# Altium project SCH-90818_A.PrjPcb (part 1 of 3)
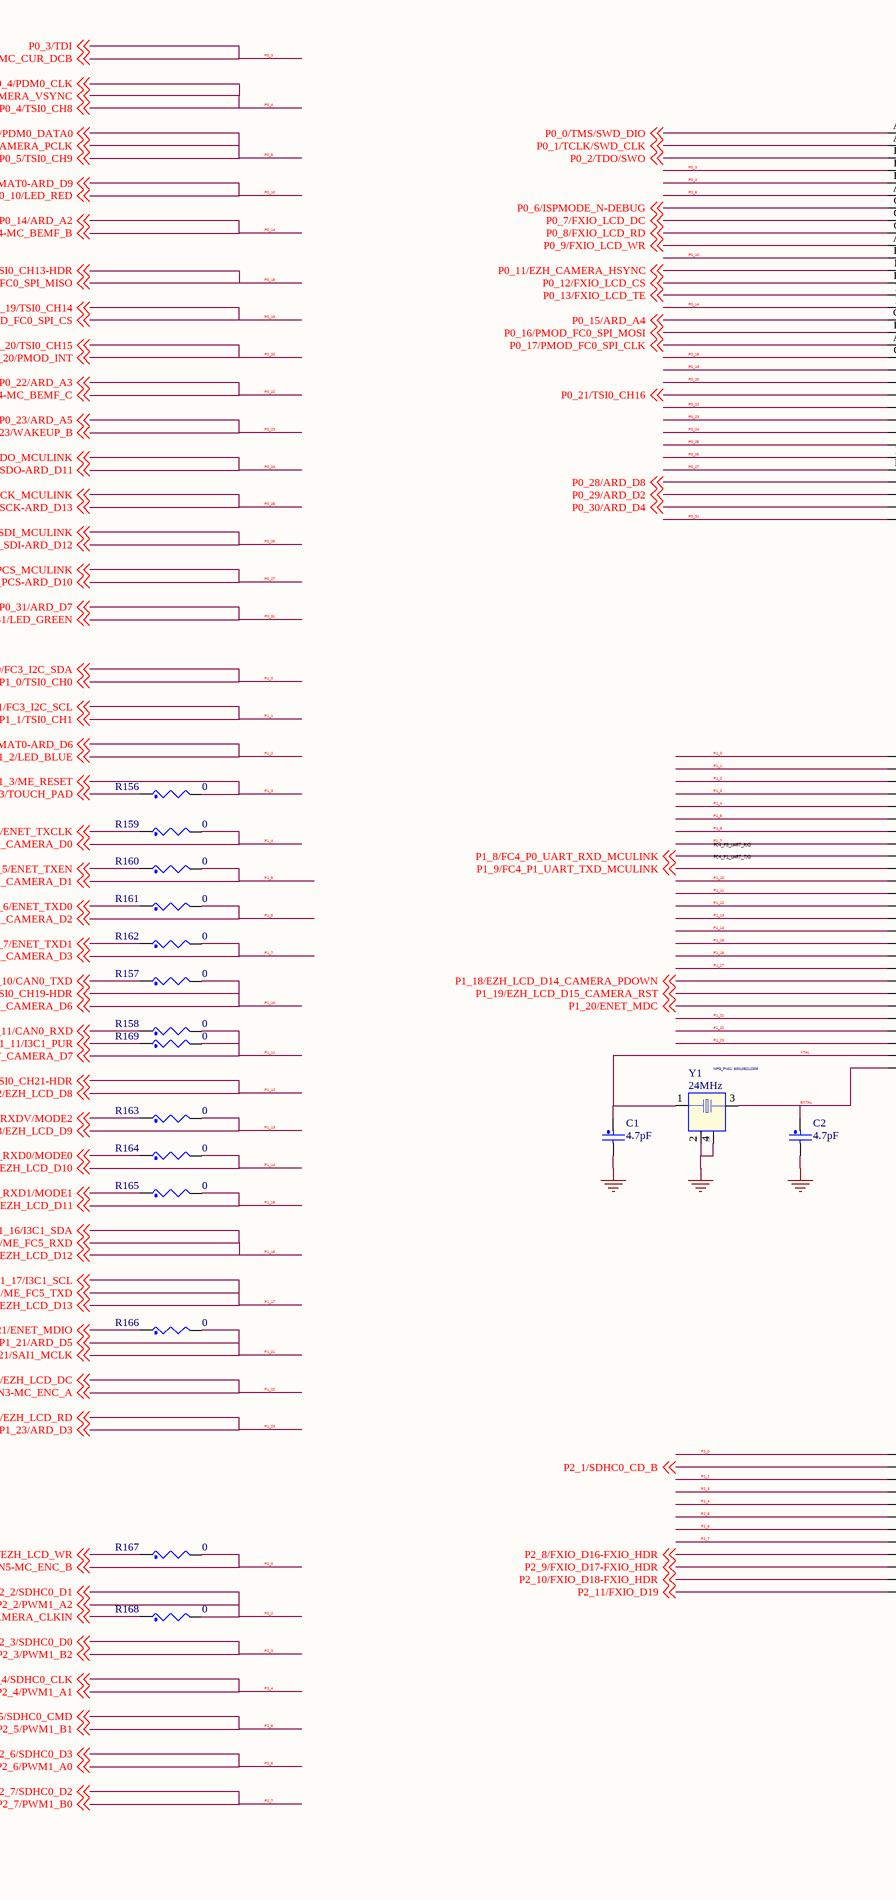
[diagram p0: 03 SOC_PORT0~2.SchDoc, left]
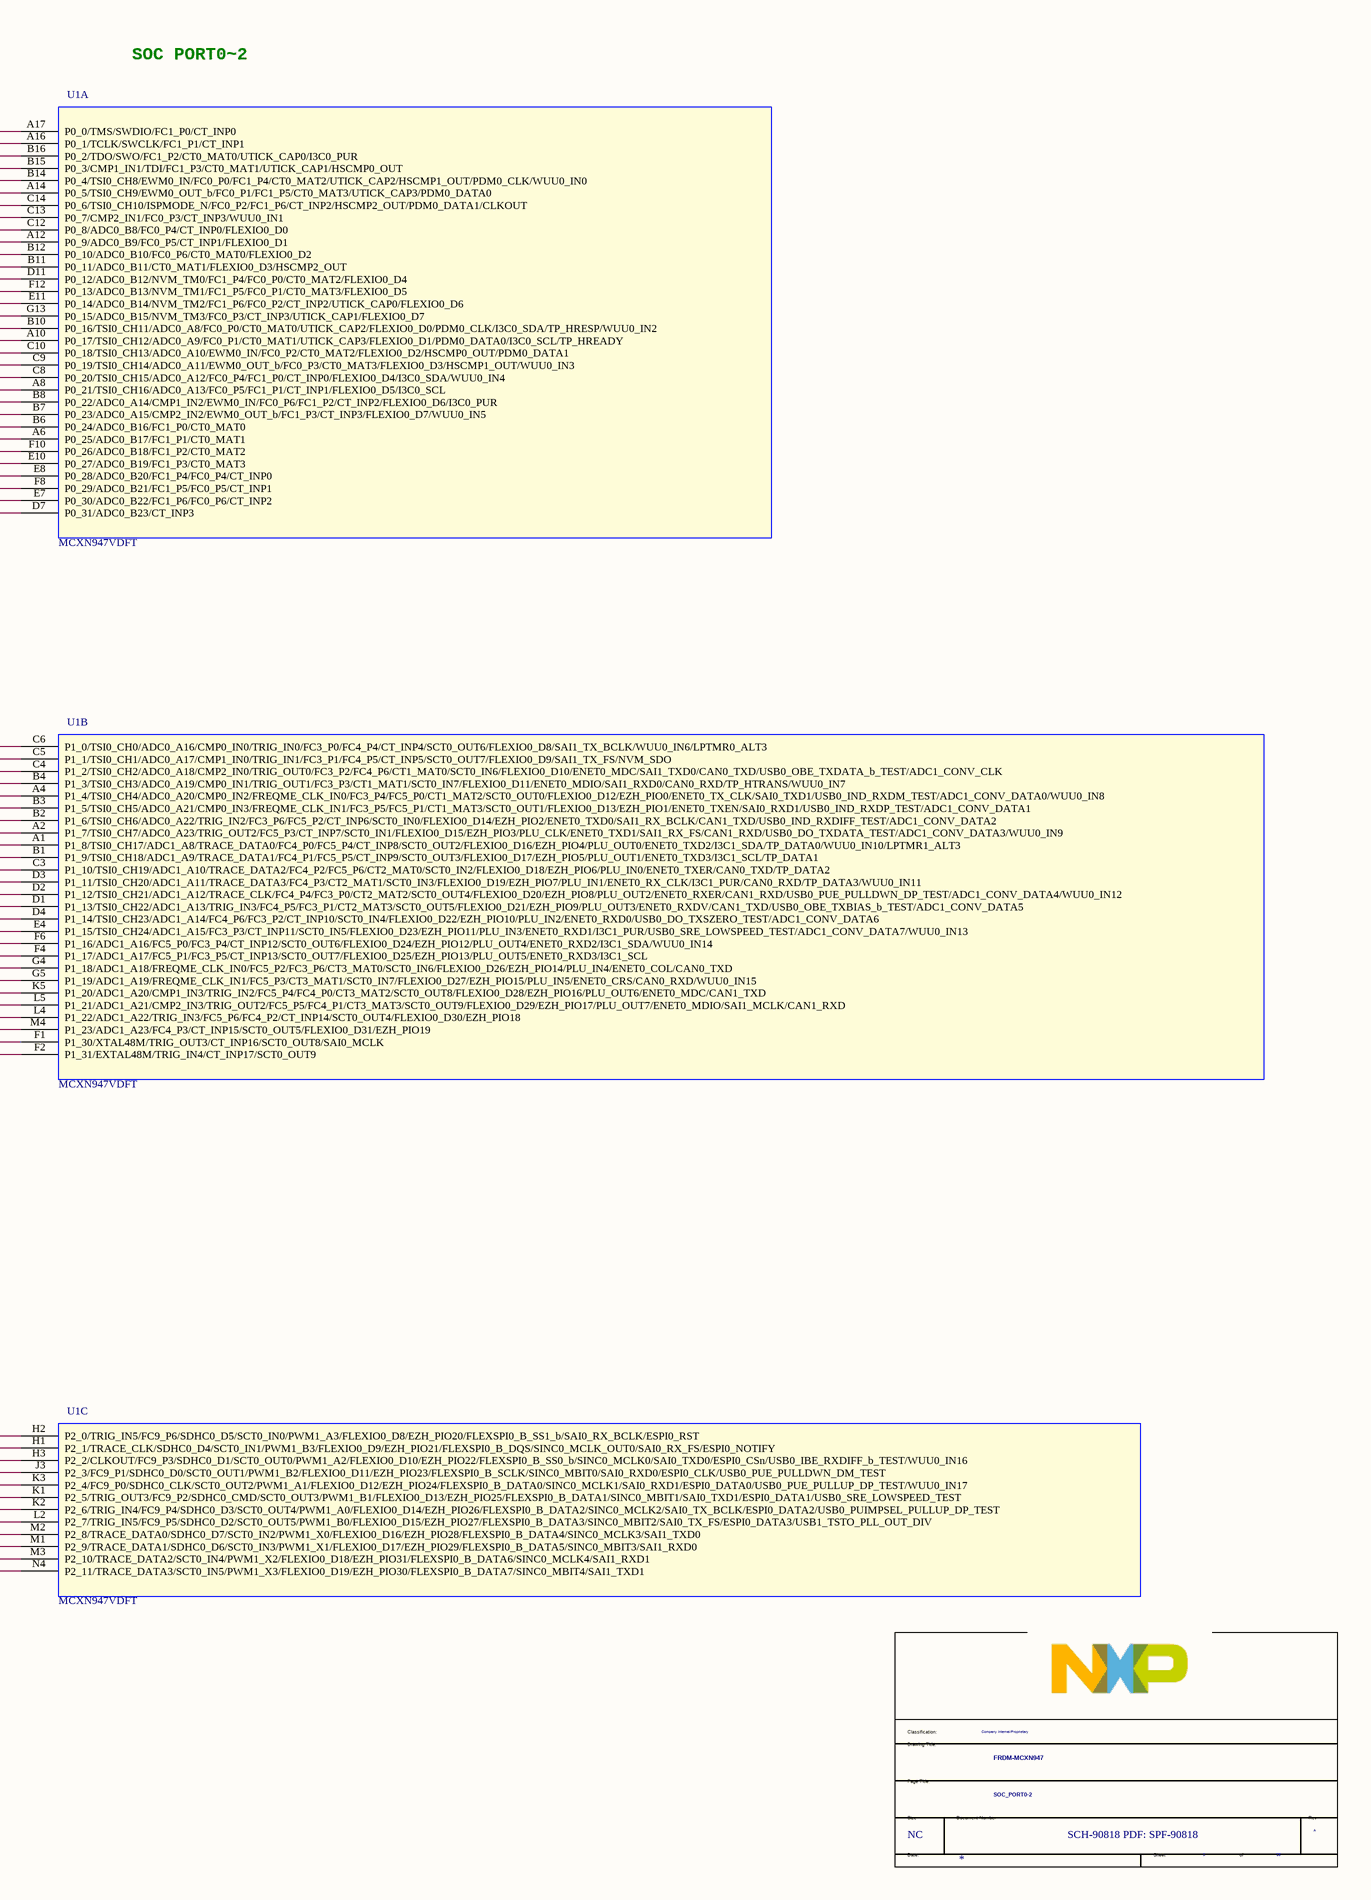
[diagram p1: 03 SOC_PORT0~2.SchDoc, right]
7 sheets, 307 parts. Net scope: global (net labels, ports and power ports of the same name join across sheets).
Sheets:
  03 SOC_PORT0~2.SchDoc
  04 SOC_PORT3~5.SchDoc
  06 USB & PWR.SchDoc
  07 SD & QSPI & SENSOR.SchDoc
  08 CAN PHY & ETHERNET P.SchDoc
  09 MCU_LINK_USB.SchDoc
  10 MCU_LINK_DEBUG.SchDoc

## Sheet 03 SOC_PORT0~2.SchDoc
size 513 x 386 mm

### Parts
(Parts that share a designator on the sheet are numbered #1, #2 ... from top to bottom, then left to right.)
*#1  Doc: SCH-90818 PDF: SPF-90818  RevCode: A  Title: FRDM-MCXN947  Page Size: NC  Page Number: 3  Page Count: 13  PageTitle: SOC_PORT0-2  Classification: Company Internal/Proprietary  (hidden comment: TitleBlock_FS)  (graphical)
C1  4.7pF  [CC0402_25]
C2  4.7pF  [CC0402_25]
R156  0  [RC0603_OV]
R157  0  [RC0603_OV]
R158  0  [RC0603_OV]
R159  0  [RC0603_OV]
R160  0  [RC0603_OV]
R161  0  [RC0603_OV]
R162  0  [RC0603_OV]
R163  0  [RC0603_OV]
R164  0  [RC0603_OV]
R165  0  [RC0603_OV]
R166  0  [RC0603_OV]
R167  0  [RC0402_25]
R168  0  [RC0603_OV]
R169  0  [RC0402_25]
U1  MCXN947VDFT  [bga184_0p5_9x9_sm]  (parts A,B,C of 8)
Y1  24MHz  MFG_PN01: 830108212309  [xtal4_2p1x1p7mm_sm]

### Nets
GND: C1.2 C2.2 Y1.2(GND1) Y1.4(GND2)
EXTAL: C2.1 U1.F2(P1_31/EXTAL48M/TRIG_IN4/CT_INP17/SCT0_OUT9) Y1.3
P0_0/TMS/SWD_DIO: U1.A17(P0_0/TMS/SWDIO/FC1_P0/CT_INP0) ; off-sheet P0_0/TMS/SWD_DIO
P0_1/TCLK/SWD_CLK: U1.A16(P0_1/TCLK/SWCLK/FC1_P1/CT_INP1) ; off-sheet P0_1/TCLK/SWD_CLK
P0_2/TDO/SWO: U1.B16(P0_2/TDO/SWO/FC1_P2/CT0_MAT0/UTICK_CAP0/I3C0_PUR) ; off-sheet P0_2/TDO/SWO
P0_3: U1.B15(P0_3/CMP1_IN1/TDI/FC1_P3/CT0_MAT1/UTICK_CAP1/HSCMP0_OUT) ; off-sheet P0_3/CMP1_IN1-MC_CUR_DCB, off-sheet P0_3/TDI  [also labelled P0_3/CMP1_IN1-MC_CUR_DCB, P0_3/TDI]
P0_4: U1.B14(P0_4/TSI0_CH8/EWM0_IN/FC0_P0/FC1_P4/CT0_MAT2/UTICK_CAP2/HSCMP1_OUT/PDM0_CLK/WUU0_IN0) ; off-sheet P0_4/TSI0_CH8, off-sheet P0_4/PDM0_CLK, off-sheet P0_4/EZH_CAMERA_VSYNC  [also labelled P0_4/EZH_CAMERA_VSYNC, P0_4/PDM0_CLK, P0_4/TSI0_CH8]
P0_5: U1.A14(P0_5/TSI0_CH9/EWM0_OUT_b/FC0_P1/FC1_P5/CT0_MAT3/UTICK_CAP3/PDM0_DATA0) ; off-sheet P0_5/EZH_CAMERA_PCLK, off-sheet P0_5/PDM0_DATA0, off-sheet P0_5/TSI0_CH9  [also labelled P0_5/EZH_CAMERA_PCLK, P0_5/PDM0_DATA0, P0_5/TSI0_CH9]
P0_6/ISPMODE_N-DEBUG: U1.C14(P0_6/TSI0_CH10/ISPMODE_N/FC0_P2/FC1_P6/CT_INP2/HSCMP2_OUT/PDM0_DATA1/CLKOUT) ; off-sheet P0_6/ISPMODE_N-DEBUG
P0_7/FXIO_LCD_DC: U1.C13(P0_7/CMP2_IN1/FC0_P3/CT_INP3/WUU0_IN1) ; off-sheet P0_7/FXIO_LCD_DC
P0_8/FXIO_LCD_RD: U1.C12(P0_8/ADC0_B8/FC0_P4/CT_INP0/FLEXIO0_D0) ; off-sheet P0_8/FXIO_LCD_RD
P0_9/FXIO_LCD_WR: U1.A12(P0_9/ADC0_B9/FC0_P5/CT_INP1/FLEXIO0_D1) ; off-sheet P0_9/FXIO_LCD_WR
P0_10: U1.B12(P0_10/ADC0_B10/FC0_P6/CT0_MAT0/FLEXIO0_D2) ; off-sheet P0_10/LED_RED, off-sheet P0_10/CT0_MAT0-ARD_D9  [also labelled P0_10/CT0_MAT0-ARD_D9, P0_10/LED_RED]
P0_11/EZH_CAMERA_HSYNC: U1.B11(P0_11/ADC0_B11/CT0_MAT1/FLEXIO0_D3/HSCMP2_OUT) ; off-sheet P0_11/EZH_CAMERA_HSYNC
P0_12/FXIO_LCD_CS: U1.D11(P0_12/ADC0_B12/NVM_TM0/FC1_P4/FC0_P0/CT0_MAT2/FLEXIO0_D4) ; off-sheet P0_12/FXIO_LCD_CS
P0_13/FXIO_LCD_TE: U1.F12(P0_13/ADC0_B13/NVM_TM1/FC1_P5/FC0_P1/CT0_MAT3/FLEXIO0_D5) ; off-sheet P0_13/FXIO_LCD_TE
P0_14: U1.E11(P0_14/ADC0_B14/NVM_TM2/FC1_P6/FC0_P2/CT_INP2/UTICK_CAP0/FLEXIO0_D6) ; off-sheet P0_14/ARD_A2, off-sheet P0_14/ADC0_B14-MC_BEMF_B  [also labelled P0_14/ADC0_B14-MC_BEMF_B, P0_14/ARD_A2]
P0_15/ARD_A4: U1.G13(P0_15/ADC0_B15/NVM_TM3/FC0_P3/CT_INP3/UTICK_CAP1/FLEXIO0_D7) ; off-sheet P0_15/ARD_A4
P0_16/PMOD_FC0_SPI_MOSI: U1.B10(P0_16/TSI0_CH11/ADC0_A8/FC0_P0/CT0_MAT0/UTICK_CAP2/FLEXIO0_D0/PDM0_CLK/I3C0_SDA/TP_HRESP/WUU0_IN2) ; off-sheet P0_16/PMOD_FC0_SPI_MOSI
P0_17/PMOD_FC0_SPI_CLK: U1.A10(P0_17/TSI0_CH12/ADC0_A9/FC0_P1/CT0_MAT1/UTICK_CAP3/FLEXIO0_D1/PDM0_DATA0/I3C0_SCL/TP_HREADY) ; off-sheet P0_17/PMOD_FC0_SPI_CLK
P0_18: U1.C10(P0_18/TSI0_CH13/ADC0_A10/EWM0_IN/FC0_P2/CT0_MAT2/FLEXIO0_D2/HSCMP0_OUT/PDM0_DATA1) ; off-sheet P0_18/TSI0_CH13-HDR, off-sheet P0_18/PMOD_FC0_SPI_MISO  [also labelled P0_18/PMOD_FC0_SPI_MISO, P0_18/TSI0_CH13-HDR]
P0_19: U1.C9(P0_19/TSI0_CH14/ADC0_A11/EWM0_OUT_b/FC0_P3/CT0_MAT3/FLEXIO0_D3/HSCMP1_OUT/WUU0_IN3) ; off-sheet P0_19/TSI0_CH14, off-sheet P0_19/PMOD_FC0_SPI_CS  [also labelled P0_19/PMOD_FC0_SPI_CS, P0_19/TSI0_CH14]
P0_20: U1.C8(P0_20/TSI0_CH15/ADC0_A12/FC0_P4/FC1_P0/CT_INP0/FLEXIO0_D4/I3C0_SDA/WUU0_IN4) ; off-sheet P0_20/TSI0_CH15, off-sheet P0_20/PMOD_INT  [also labelled P0_20/PMOD_INT, P0_20/TSI0_CH15]
P0_21/TSI0_CH16: U1.A8(P0_21/TSI0_CH16/ADC0_A13/FC0_P5/FC1_P1/CT_INP1/FLEXIO0_D5/I3C0_SCL) ; off-sheet P0_21/TSI0_CH16
P0_22: U1.B8(P0_22/ADC0_A14/CMP1_IN2/EWM0_IN/FC0_P6/FC1_P2/CT_INP2/FLEXIO0_D6/I3C0_PUR) ; off-sheet P0_22/ARD_A3, off-sheet P0_22/ADC0_A14-MC_BEMF_C  [also labelled P0_22/ADC0_A14-MC_BEMF_C, P0_22/ARD_A3]
P0_23: U1.B7(P0_23/ADC0_A15/CMP2_IN2/EWM0_OUT_b/FC1_P3/CT_INP3/FLEXIO0_D7/WUU0_IN5) ; off-sheet P0_23/WAKEUP_B, off-sheet P0_23/ARD_A5  [also labelled P0_23/ARD_A5, P0_23/WAKEUP_B]
P0_24: U1.B6(P0_24/ADC0_B16/FC1_P0/CT0_MAT0) ; off-sheet P0_24/FC1_SPI_SDO_MCULINK, off-sheet P0_24/FC1_SPI_SDO-ARD_D11  [also labelled P0_24/FC1_SPI_SDO-ARD_D11, P0_24/FC1_SPI_SDO_MCULINK]
P0_25: U1.A6(P0_25/ADC0_B17/FC1_P1/CT0_MAT1) ; off-sheet P0_25/FCI_SPI_SCK_MCULINK, off-sheet P0_25/FCI_SPI_SCK-ARD_D13  [also labelled P0_25/FCI_SPI_SCK-ARD_D13, P0_25/FCI_SPI_SCK_MCULINK]
P0_26: U1.F10(P0_26/ADC0_B18/FC1_P2/CT0_MAT2) ; off-sheet P0_26/FC1_SPI_SDI_MCULINK, off-sheet P0_26/FC1_SPI_SDI-ARD_D12  [also labelled P0_26/FC1_SPI_SDI-ARD_D12, P0_26/FC1_SPI_SDI_MCULINK]
P0_27: U1.E10(P0_27/ADC0_B19/FC1_P3/CT0_MAT3) ; off-sheet P0_27/FC1_SPI_PCS_MCULINK, off-sheet P0_27/FC1_SPI_PCS-ARD_D10  [also labelled P0_27/FC1_SPI_PCS-ARD_D10, P0_27/FC1_SPI_PCS_MCULINK]
P0_28/ARD_D8: U1.E8(P0_28/ADC0_B20/FC1_P4/FC0_P4/CT_INP0) ; off-sheet P0_28/ARD_D8
P0_29/ARD_D2: U1.F8(P0_29/ADC0_B21/FC1_P5/FC0_P5/CT_INP1) ; off-sheet P0_29/ARD_D2
P0_30/ARD_D4: U1.E7(P0_30/ADC0_B22/FC1_P6/FC0_P6/CT_INP2) ; off-sheet P0_30/ARD_D4
P0_31: U1.D7(P0_31/ADC0_B23/CT_INP3) ; off-sheet P0_31/LED_GREEN, off-sheet P0_31/ARD_D7  [also labelled P0_31/ARD_D7, P0_31/LED_GREEN]
P1_0: U1.C6(P1_0/TSI0_CH0/ADC0_A16/CMP0_IN0/TRIG_IN0/FC3_P0/FC4_P4/CT_INP4/SCT0_OUT6/FLEXIO0_D8/SAI1_TX_BCLK/WUU0_IN6/LPTMR0_ALT3) ; off-sheet P1_0/FC3_I2C_SDA, off-sheet P1_0/TSI0_CH0  [also labelled P1_0/FC3_I2C_SDA, P1_0/TSI0_CH0]
P1_1: U1.C5(P1_1/TSI0_CH1/ADC0_A17/CMP1_IN0/TRIG_IN1/FC3_P1/FC4_P5/CT_INP5/SCT0_OUT7/FLEXIO0_D9/SAI1_TX_FS/NVM_SDO) ; off-sheet P1_1/FC3_I2C_SCL, off-sheet P1_1/TSI0_CH1  [also labelled P1_1/FC3_I2C_SCL, P1_1/TSI0_CH1]
P1_2: U1.C4(P1_2/TSI0_CH2/ADC0_A18/CMP2_IN0/TRIG_OUT0/FC3_P2/FC4_P6/CT1_MAT0/SCT0_IN6/FLEXIO0_D10/ENET0_MDC/SAI1_TXD0/CAN0_TXD/USB0_OBE_TXDATA_b_TEST/ADC1_CONV_CLK) ; off-sheet P1_2/LED_BLUE, off-sheet P1_2/CT1_MAT0-ARD_D6  [also labelled P1_2/CT1_MAT0-ARD_D6, P1_2/LED_BLUE]
P1_3: R156.2 U1.B4(P1_3/TSI0_CH3/ADC0_A19/CMP0_IN1/TRIG_OUT1/FC3_P3/CT1_MAT1/SCT0_IN7/FLEXIO0_D11/ENET0_MDIO/SAI1_RXD0/CAN0_RXD/TP_HTRANS/WUU0_IN7) ; off-sheet P1_3/ME_RESET  [also labelled P1_3/ME_RESET]
P1_3/TOUCH_PAD: R156.1 ; off-sheet P1_3/TOUCH_PAD
P1_4: R159.2 U1.A4(P1_4/TSI0_CH4/ADC0_A20/CMP0_IN2/FREQME_CLK_IN0/FC3_P4/FC5_P0/CT1_MAT2/SCT0_OUT0/FLEXIO0_D12/EZH_PIO0/ENET0_TX_CLK/SAI0_TXD1/USB0_IND_RXDM_TEST/ADC1_CONV_DATA0/WUU0_IN8) ; off-sheet P1_4/EZH_LCD_D0_CAMERA_D0  [also labelled P1_4/EZH_LCD_D0_CAMERA_D0]
P1_4/ENET_TXCLK: R159.1 ; off-sheet P1_4/ENET_TXCLK
P1_5: R160.2 U1.B3(P1_5/TSI0_CH5/ADC0_A21/CMP0_IN3/FREQME_CLK_IN1/FC3_P5/FC5_P1/CT1_MAT3/SCT0_OUT1/FLEXIO0_D13/EZH_PIO1/ENET0_TXEN/SAI0_RXD1/USB0_IND_RXDP_TEST/ADC1_CONV_DATA1) ; off-sheet P1_5/EZH_LCD_D1_CAMERA_D1  [also labelled P1_5/EZH_LCD_D1_CAMERA_D1]
P1_5/ENET_TXEN: R160.1 ; off-sheet P1_5/ENET_TXEN
P1_6: R161.2 U1.B2(P1_6/TSI0_CH6/ADC0_A22/TRIG_IN2/FC3_P6/FC5_P2/CT_INP6/SCT0_IN0/FLEXIO0_D14/EZH_PIO2/ENET0_TXD0/SAI1_RX_BCLK/CAN1_TXD/USB0_IND_RXDIFF_TEST/ADC1_CONV_DATA2) ; off-sheet P1_6/EZH_LCD_D2_CAMERA_D2  [also labelled P1_6/EZH_LCD_D2_CAMERA_D2]
P1_6/ENET_TXD0: R161.1 ; off-sheet P1_6/ENET_TXD0
P1_7: R162.2 U1.A2(P1_7/TSI0_CH7/ADC0_A23/TRIG_OUT2/FC5_P3/CT_INP7/SCT0_IN1/FLEXIO0_D15/EZH_PIO3/PLU_CLK/ENET0_TXD1/SAI1_RX_FS/CAN1_RXD/USB0_DO_TXDATA_TEST/ADC1_CONV_DATA3/WUU0_IN9) ; off-sheet P1_7/EZH_LCD_D3_CAMERA_D3  [also labelled P1_7/EZH_LCD_D3_CAMERA_D3]
P1_7/ENET_TXD1: R162.1 ; off-sheet P1_7/ENET_TXD1
P1_8/FC4_P0_UART_RXD_MCULINK: U1.A1(P1_8/TSI0_CH17/ADC1_A8/TRACE_DATA0/FC4_P0/FC5_P4/CT_INP8/SCT0_OUT2/FLEXIO0_D16/EZH_PIO4/PLU_OUT0/ENET0_TXD2/I3C1_SDA/TP_DATA0/WUU0_IN10/LPTMR1_ALT3) ; off-sheet P1_8/FC4_P0_UART_RXD_MCULINK
P1_9/FC4_P1_UART_TXD_MCULINK: U1.B1(P1_9/TSI0_CH18/ADC1_A9/TRACE_DATA1/FC4_P1/FC5_P5/CT_INP9/SCT0_OUT3/FLEXIO0_D17/EZH_PIO5/PLU_OUT1/ENET0_TXD3/I3C1_SCL/TP_DATA1) ; off-sheet P1_9/FC4_P1_UART_TXD_MCULINK
P1_10: R157.2 U1.C3(P1_10/TSI0_CH19/ADC1_A10/TRACE_DATA2/FC4_P2/FC5_P6/CT2_MAT0/SCT0_IN2/FLEXIO0_D18/EZH_PIO6/PLU_IN0/ENET0_TXER/CAN0_TXD/TP_DATA2) ; off-sheet P1_10/EZH_LCD_D6_CAMERA_D6, off-sheet P1_10/TSI0_CH19-HDR  [also labelled P1_10/EZH_LCD_D6_CAMERA_D6, P1_10/TSI0_CH19-HDR]
P1_10/CAN0_TXD: R157.1 ; off-sheet P1_10/CAN0_TXD
P1_11: R158.2 R169.2 U1.D3(P1_11/TSI0_CH20/ADC1_A11/TRACE_DATA3/FC4_P3/CT2_MAT1/SCT0_IN3/FLEXIO0_D19/EZH_PIO7/PLU_IN1/ENET0_RX_CLK/I3C1_PUR/CAN0_RXD/TP_DATA3/WUU0_IN11) ; off-sheet P1_11/EZH_LCD_D7_CAMERA_D7  [also labelled P1_11/EZH_LCD_D7_CAMERA_D7]
P1_11/CAN0_RXD: R158.1 ; off-sheet P1_11/CAN0_RXD
P1_11/I3C1_PUR: R169.1 ; off-sheet P1_11/I3C1_PUR
P1_12: U1.D2(P1_12/TSI0_CH21/ADC1_A12/TRACE_CLK/FC4_P4/FC3_P0/CT2_MAT2/SCT0_OUT4/FLEXIO0_D20/EZH_PIO8/PLU_OUT2/ENET0_RXER/CAN1_RXD/USB0_PUE_PULLDWN_DP_TEST/ADC1_CONV_DATA4/WUU0_IN12) ; off-sheet P1_12/EZH_LCD_D8, off-sheet P1_12/TSI0_CH21-HDR  [also labelled P1_12/EZH_LCD_D8, P1_12/TSI0_CH21-HDR]
P1_13: R163.2 U1.D1(P1_13/TSI0_CH22/ADC1_A13/TRIG_IN3/FC4_P5/FC3_P1/CT2_MAT3/SCT0_OUT5/FLEXIO0_D21/EZH_PIO9/PLU_OUT3/ENET0_RXDV/CAN1_TXD/USB0_OBE_TXBIAS_b_TEST/ADC1_CONV_DATA5) ; off-sheet P1_13/EZH_LCD_D9  [also labelled P1_13/EZH_LCD_D9]
P1_13/ENET_RXDV/MODE2: R163.1 ; off-sheet P1_13/ENET_RXDV/MODE2
P1_14: R164.2 U1.D4(P1_14/TSI0_CH23/ADC1_A14/FC4_P6/FC3_P2/CT_INP10/SCT0_IN4/FLEXIO0_D22/EZH_PIO10/PLU_IN2/ENET0_RXD0/USB0_DO_TXSZERO_TEST/ADC1_CONV_DATA6) ; off-sheet P1_14/EZH_LCD_D10  [also labelled P1_14/EZH_LCD_D10]
P1_14/ENET_RXD0/MODE0: R164.1 ; off-sheet P1_14/ENET_RXD0/MODE0
P1_15: R165.2 U1.E4(P1_15/TSI0_CH24/ADC1_A15/FC3_P3/CT_INP11/SCT0_IN5/FLEXIO0_D23/EZH_PIO11/PLU_IN3/ENET0_RXD1/I3C1_PUR/USB0_SRE_LOWSPEED_TEST/ADC1_CONV_DATA7/WUU0_IN13) ; off-sheet P1_15/EZH_LCD_D11  [also labelled P1_15/EZH_LCD_D11]
P1_15/ENET_RXD1/MODE1: R165.1 ; off-sheet P1_15/ENET_RXD1/MODE1
P1_16: U1.F6(P1_16/ADC1_A16/FC5_P0/FC3_P4/CT_INP12/SCT0_OUT6/FLEXIO0_D24/EZH_PIO12/PLU_OUT4/ENET0_RXD2/I3C1_SDA/WUU0_IN14) ; off-sheet P1_16/I3C1_SDA, off-sheet P1_16/ME_FC5_RXD, off-sheet P1_16/EZH_LCD_D12  [also labelled P1_16/EZH_LCD_D12, P1_16/I3C1_SDA, P1_16/ME_FC5_RXD]
P1_17: U1.F4(P1_17/ADC1_A17/FC5_P1/FC3_P5/CT_INP13/SCT0_OUT7/FLEXIO0_D25/EZH_PIO13/PLU_OUT5/ENET0_RXD3/I3C1_SCL) ; off-sheet P1_17/I3C1_SCL, off-sheet P1_17/ME_FC5_TXD, off-sheet P1_17/EZH_LCD_D13  [also labelled P1_17/EZH_LCD_D13, P1_17/I3C1_SCL, P1_17/ME_FC5_TXD]
P1_18/EZH_LCD_D14_CAMERA_PDOWN: U1.G4(P1_18/ADC1_A18/FREQME_CLK_IN0/FC5_P2/FC3_P6/CT3_MAT0/SCT0_IN6/FLEXIO0_D26/EZH_PIO14/PLU_IN4/ENET0_COL/CAN0_TXD) ; off-sheet P1_18/EZH_LCD_D14_CAMERA_PDOWN
P1_19/EZH_LCD_D15_CAMERA_RST: U1.G5(P1_19/ADC1_A19/FREQME_CLK_IN1/FC5_P3/CT3_MAT1/SCT0_IN7/FLEXIO0_D27/EZH_PIO15/PLU_IN5/ENET0_CRS/CAN0_RXD/WUU0_IN15) ; off-sheet P1_19/EZH_LCD_D15_CAMERA_RST
P1_20/ENET_MDC: U1.K5(P1_20/ADC1_A20/CMP1_IN3/TRIG_IN2/FC5_P4/FC4_P0/CT3_MAT2/SCT0_OUT8/FLEXIO0_D28/EZH_PIO16/PLU_OUT6/ENET0_MDC/CAN1_TXD) ; off-sheet P1_20/ENET_MDC
P1_21: R166.2 U1.L5(P1_21/ADC1_A21/CMP2_IN3/TRIG_OUT2/FC5_P5/FC4_P1/CT3_MAT3/SCT0_OUT9/FLEXIO0_D29/EZH_PIO17/PLU_OUT7/ENET0_MDIO/SAI1_MCLK/CAN1_RXD) ; off-sheet P1_21/ARD_D5, off-sheet P1_21/SAI1_MCLK  [also labelled P1_21/ARD_D5, P1_21/SAI1_MCLK]
P1_21/ENET_MDIO: R166.1 ; off-sheet P1_21/ENET_MDIO
P1_22: U1.L4(P1_22/ADC1_A22/TRIG_IN3/FC5_P6/FC4_P2/CT_INP14/SCT0_OUT4/FLEXIO0_D30/EZH_PIO18) ; off-sheet P1_22/EZH_LCD_DC, off-sheet P1_22/TRIG_IN3-MC_ENC_A  [also labelled P1_22/EZH_LCD_DC, P1_22/TRIG_IN3-MC_ENC_A]
P1_23: U1.M4(P1_23/ADC1_A23/FC4_P3/CT_INP15/SCT0_OUT5/FLEXIO0_D31/EZH_PIO19) ; off-sheet P1_23/EZH_LCD_RD, off-sheet P1_23/ARD_D3  [also labelled P1_23/ARD_D3, P1_23/EZH_LCD_RD]
P2_0: R167.2 U1.H2(P2_0/TRIG_IN5/FC9_P6/SDHC0_D5/SCT0_IN0/PWM1_A3/FLEXIO0_D8/EZH_PIO20/FLEXSPI0_B_SS1_b/SAI0_RX_BCLK/ESPI0_RST) ; off-sheet P2_0/TRIG_IN5-MC_ENC_B  [also labelled P2_0/TRIG_IN5-MC_ENC_B]
P2_0/EZH_LCD_WR: R167.1 ; off-sheet P2_0/EZH_LCD_WR
P2_1/SDHC0_CD_B: U1.H1(P2_1/TRACE_CLK/SDHC0_D4/SCT0_IN1/PWM1_B3/FLEXIO0_D9/EZH_PIO21/FLEXSPI0_B_DQS/SINC0_MCLK_OUT0/SAI0_RX_FS/ESPI0_NOTIFY) ; off-sheet P2_1/SDHC0_CD_B
P2_2: R168.2 U1.H3(P2_2/CLKOUT/FC9_P3/SDHC0_D1/SCT0_OUT0/PWM1_A2/FLEXIO0_D10/EZH_PIO22/FLEXSPI0_B_SS0_b/SINC0_MCLK0/SAI0_TXD0/ESPI0_CSn/USB0_IBE_RXDIFF_b_TEST/WUU0_IN16) ; off-sheet P2_2/SDHC0_D1, off-sheet P2_2/PWM1_A2  [also labelled P2_2/PWM1_A2, P2_2/SDHC0_D1]
P2_2/CAMERA_CLKIN: R168.1 ; off-sheet P2_2/CAMERA_CLKIN
P2_3: U1.J3(P2_3/FC9_P1/SDHC0_D0/SCT0_OUT1/PWM1_B2/FLEXIO0_D11/EZH_PIO23/FLEXSPI0_B_SCLK/SINC0_MBIT0/SAI0_RXD0/ESPI0_CLK/USB0_PUE_PULLDWN_DM_TEST) ; off-sheet P2_3/SDHC0_D0, off-sheet P2_3/PWM1_B2  [also labelled P2_3/PWM1_B2, P2_3/SDHC0_D0]
P2_4: U1.K3(P2_4/FC9_P0/SDHC0_CLK/SCT0_OUT2/PWM1_A1/FLEXIO0_D12/EZH_PIO24/FLEXSPI0_B_DATA0/SINC0_MCLK1/SAI0_RXD1/ESPI0_DATA0/USB0_PUE_PULLUP_DP_TEST/WUU0_IN17) ; off-sheet P2_4/SDHC0_CLK, off-sheet P2_4/PWM1_A1  [also labelled P2_4/PWM1_A1, P2_4/SDHC0_CLK]
P2_5: U1.K1(P2_5/TRIG_OUT3/FC9_P2/SDHC0_CMD/SCT0_OUT3/PWM1_B1/FLEXIO0_D13/EZH_PIO25/FLEXSPI0_B_DATA1/SINC0_MBIT1/SAI0_TXD1/ESPI0_DATA1/USB0_SRE_LOWSPEED_TEST) ; off-sheet P2_5/SDHC0_CMD, off-sheet P2_5/PWM1_B1  [also labelled P2_5/PWM1_B1, P2_5/SDHC0_CMD]
P2_6: U1.K2(P2_6/TRIG_IN4/FC9_P4/SDHC0_D3/SCT0_OUT4/PWM1_A0/FLEXIO0_D14/EZH_PIO26/FLEXSPI0_B_DATA2/SINC0_MCLK2/SAI0_TX_BCLK/ESPI0_DATA2/USB0_PUIMPSEL_PULLUP_DP_TEST) ; off-sheet P2_6/SDHC0_D3, off-sheet P2_6/PWM1_A0  [also labelled P2_6/PWM1_A0, P2_6/SDHC0_D3]
P2_7: U1.L2(P2_7/TRIG_IN5/FC9_P5/SDHC0_D2/SCT0_OUT5/PWM1_B0/FLEXIO0_D15/EZH_PIO27/FLEXSPI0_B_DATA3/SINC0_MBIT2/SAI0_TX_FS/ESPI0_DATA3/USB1_TSTO_PLL_OUT_DIV) ; off-sheet P2_7/SDHC0_D2, off-sheet P2_7/PWM1_B0  [also labelled P2_7/PWM1_B0, P2_7/SDHC0_D2]
P2_8/FXIO_D16-FXIO_HDR: U1.M2(P2_8/TRACE_DATA0/SDHC0_D7/SCT0_IN2/PWM1_X0/FLEXIO0_D16/EZH_PIO28/FLEXSPI0_B_DATA4/SINC0_MCLK3/SAI1_TXD0) ; off-sheet P2_8/FXIO_D16-FXIO_HDR
P2_9/FXIO_D17-FXIO_HDR: U1.M1(P2_9/TRACE_DATA1/SDHC0_D6/SCT0_IN3/PWM1_X1/FLEXIO0_D17/EZH_PIO29/FLEXSPI0_B_DATA5/SINC0_MBIT3/SAI1_RXD0) ; off-sheet P2_9/FXIO_D17-FXIO_HDR
P2_10/FXIO_D18-FXIO_HDR: U1.M3(P2_10/TRACE_DATA2/SCT0_IN4/PWM1_X2/FLEXIO0_D18/EZH_PIO31/FLEXSPI0_B_DATA6/SINC0_MCLK4/SAI1_RXD1) ; off-sheet P2_10/FXIO_D18-FXIO_HDR
P2_11/FXIO_D19: U1.N4(P2_11/TRACE_DATA3/SCT0_IN5/PWM1_X3/FLEXIO0_D19/EZH_PIO30/FLEXSPI0_B_DATA7/SINC0_MBIT4/SAI1_TXD1) ; off-sheet P2_11/FXIO_D19
XTAL: C1.1 U1.F1(P1_30/XTAL48M/TRIG_OUT3/CT_INP16/SCT0_OUT8/SAI0_MCLK) Y1.1

### Notes on the sheet
- SOC PORT0~2
- FC4_P0_UART_RXD
- FC4_P1_UART_TXD
- (in symbol TitleBlock_FS) Classification:; Drawing Title:; Page Title:; Size; Document Number; Rev; Date:; Sheet; of

### Library data of the parts
*#1 = TitleBlock_FS: Classification: Public, Company Internal/Proprietary, Company Confidential,  Company Secret; OrgName: NXP Semiconductors; OrgAddr1: 6501 William Cannon Drive West; OrgAddr2: Austin, TX 78735-8598; Variant Name: <Core Design>; Page Create Date: March  8, 1995; Page Modify Date: *
C1 = CAP_NP: CAP CER 4.7PF 50V 0.5pF C0G 0402; CLASS: DISCRETE; MFG_PN01: 885012005053; MFG_NAME01: Wurth Elektronik; Temp Range: -55C to +125C; CAD_APPROVED: yes; FPLIST: CC0402_25,CC0402_HD,0402_CC,capc0402_l; AGILE_PN: 150-80750; PCB Footprint: CC0402_25; ROHS: yes; Rated Voltage: 50V; Tolerance: 0.5pF; Package Type: SMD/SMT; HEIGHT: 0.5 mm; Package Size: 0402 (1005 metric)
C2 = CAP_NP: CAP CER 4.7PF 50V 0.5pF C0G 0402; CLASS: DISCRETE; AGILE_PN: 150-80750; FPLIST: CC0402_25,CC0402_HD,0402_CC,capc0402_l; CAD_APPROVED: yes; Temp Range: -55C to +125C; MFG_NAME01: Wurth Elektronik; MFG_PN01: 885012005053; PCB Footprint: CC0402_25; Package Size: 0402 (1005 metric); HEIGHT: 0.5 mm; Package Type: SMD/SMT; Tolerance: 0.5pF; Rated Voltage: 50V; ROHS: yes
R156-R158 R160-R165 R168 = RES: RES MF ZERO OHM 1/10W -- 0603; CLASS: DISCRETE; AGILE_PN: 470-80866; FPLIST: RC0603_OV,RC0603,R603-X2,r603-x2_b,0603_CC,IND_0603HP_NSP,CC0603_OV_NSP; CAD_APPROVED: Yes; Temp Range: ¨C55 ¡ãC to +155 ¡ãC; MFG_NAME01: YAGEO AMERICA; MFG_PN01: RC0603FR-070RL; HEIGHT: 0.6MM; ROHS: Yes; PCB Footprint: RC0603_OV
R159 R166 = RES: RES MF ZERO OHM 1/10W -- 0603; CLASS: DISCRETE; MFG_PN01: RC0603FR-070RL; MFG_NAME01: YAGEO AMERICA; Temp Range: ¨C55 ¡ãC to +155 ¡ãC; CAD_APPROVED: Yes; FPLIST: RC0603_OV,RC0603,R603-X2,r603-x2_b,0603_CC,IND_0603HP_NSP,CC0603_OV_NSP; AGILE_PN: 470-80866; ROHS: Yes; HEIGHT: 0.6MM; PCB Footprint: RC0603_OV
R167 R169 = RES: RES MF ZERO OHM 1/16W 5% 0402; CLASS: DISCRETE; AGILE_PN: 470-75394; FPLIST: RC0402_25,RC0402_HD,RC0402_X2,0402_CC,rc0402_lamp3; CAD_APPROVED: Yes; MFG_NAME01: BOURNS; MFG_PN01: CR0402-J/-000GLF; HEIGHT: 0.45 MM; Tolerance: 5%; ROHS: Yes; PCB Footprint: RC0402_25
U1 = MCXN947VDFT_BGA_184P: IC MCU LOW POWER 150MHz ARM Nirvana -- VFBGA184; SPLIT_INST: TRUE; MFG_NAME01: NXP SEMICONDUCTOR; Temp Range: -40  ¡ãC to +105 ¡ãC; PRE_APN: 344-02549; CAD_APPROVED: Yes; AGILE_PN: TMP-CIP-10342; CLASS: IC; 3D_Mechanical_Footprint_File: http://fcl.am.freescale.net/ALLEGRO/step/bga184_0p5_9x9_sm.STEP; MFG_PN01: MCXN947VDFT; ROHS: Yes; HEIGHT: 0.98 MM; Package Size: 9x9; PCB Footprint: bga184_0p5_9x9_sm
Y1 = XTAL_4PIN: XTAL 24MHz 10ppm 8pF SMT; CLASS: IC; AGILE_PN: 230-78677; Frequency Tolerance: ¡À10ppm; CAD_APPROVED: YES; Temp Range: -40¡ãC to +85¡ãC; MFG_NAME01: Wurth Electronics Inc.; HEIGHT: 0.50 MM; ROHS: Yes; 3D_Mechanical_Footprint_File: http://fcl.am.freescale.net/ALLEGRO/step/xtal4_2p1x1p7mm_sm.STEP; PCB Footprint: xtal4_2p1x1p7mm_sm

## Sheet 04 SOC_PORT3~5.SchDoc
size 513 x 386 mm
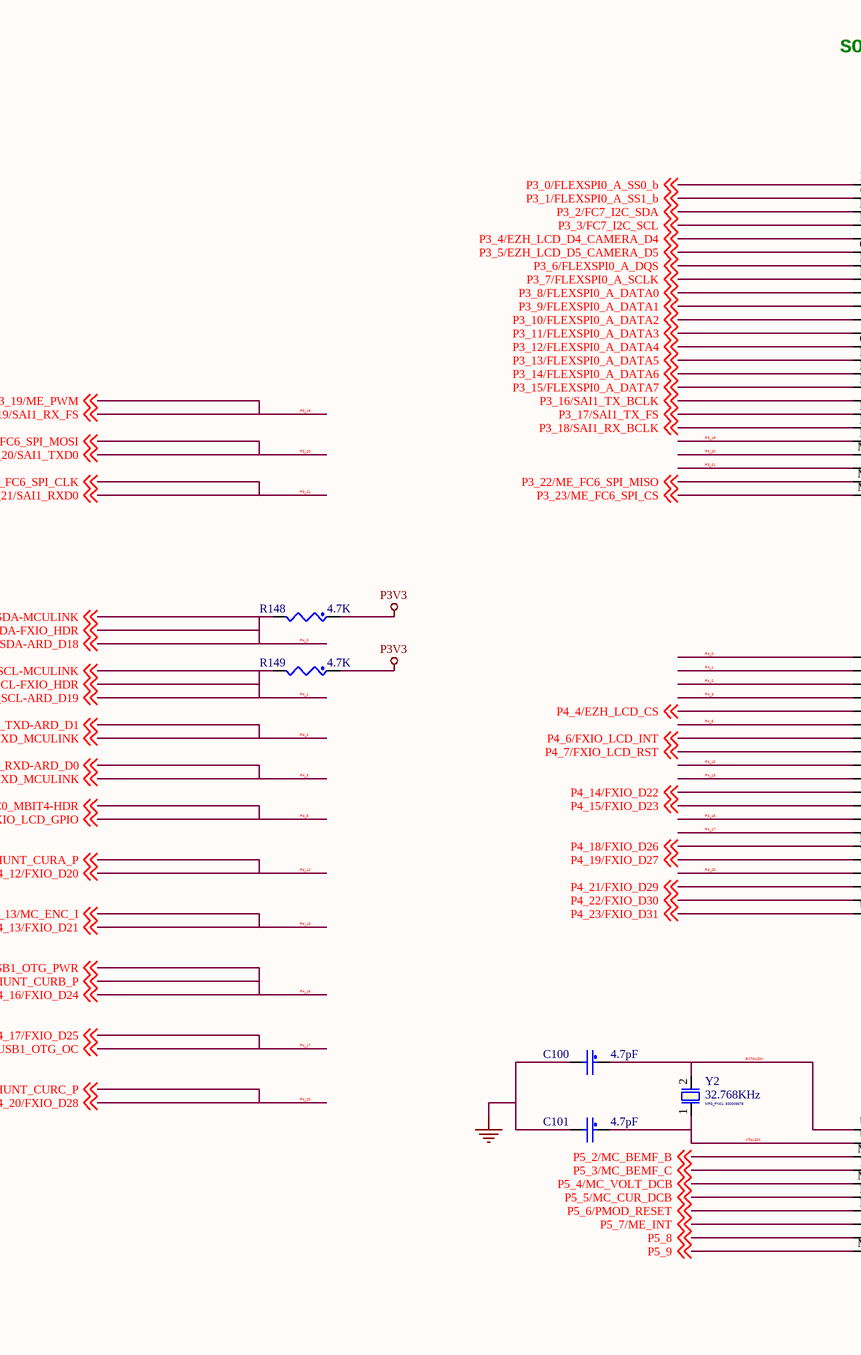
[diagram p2: 04 SOC_PORT3~5.SchDoc, left]
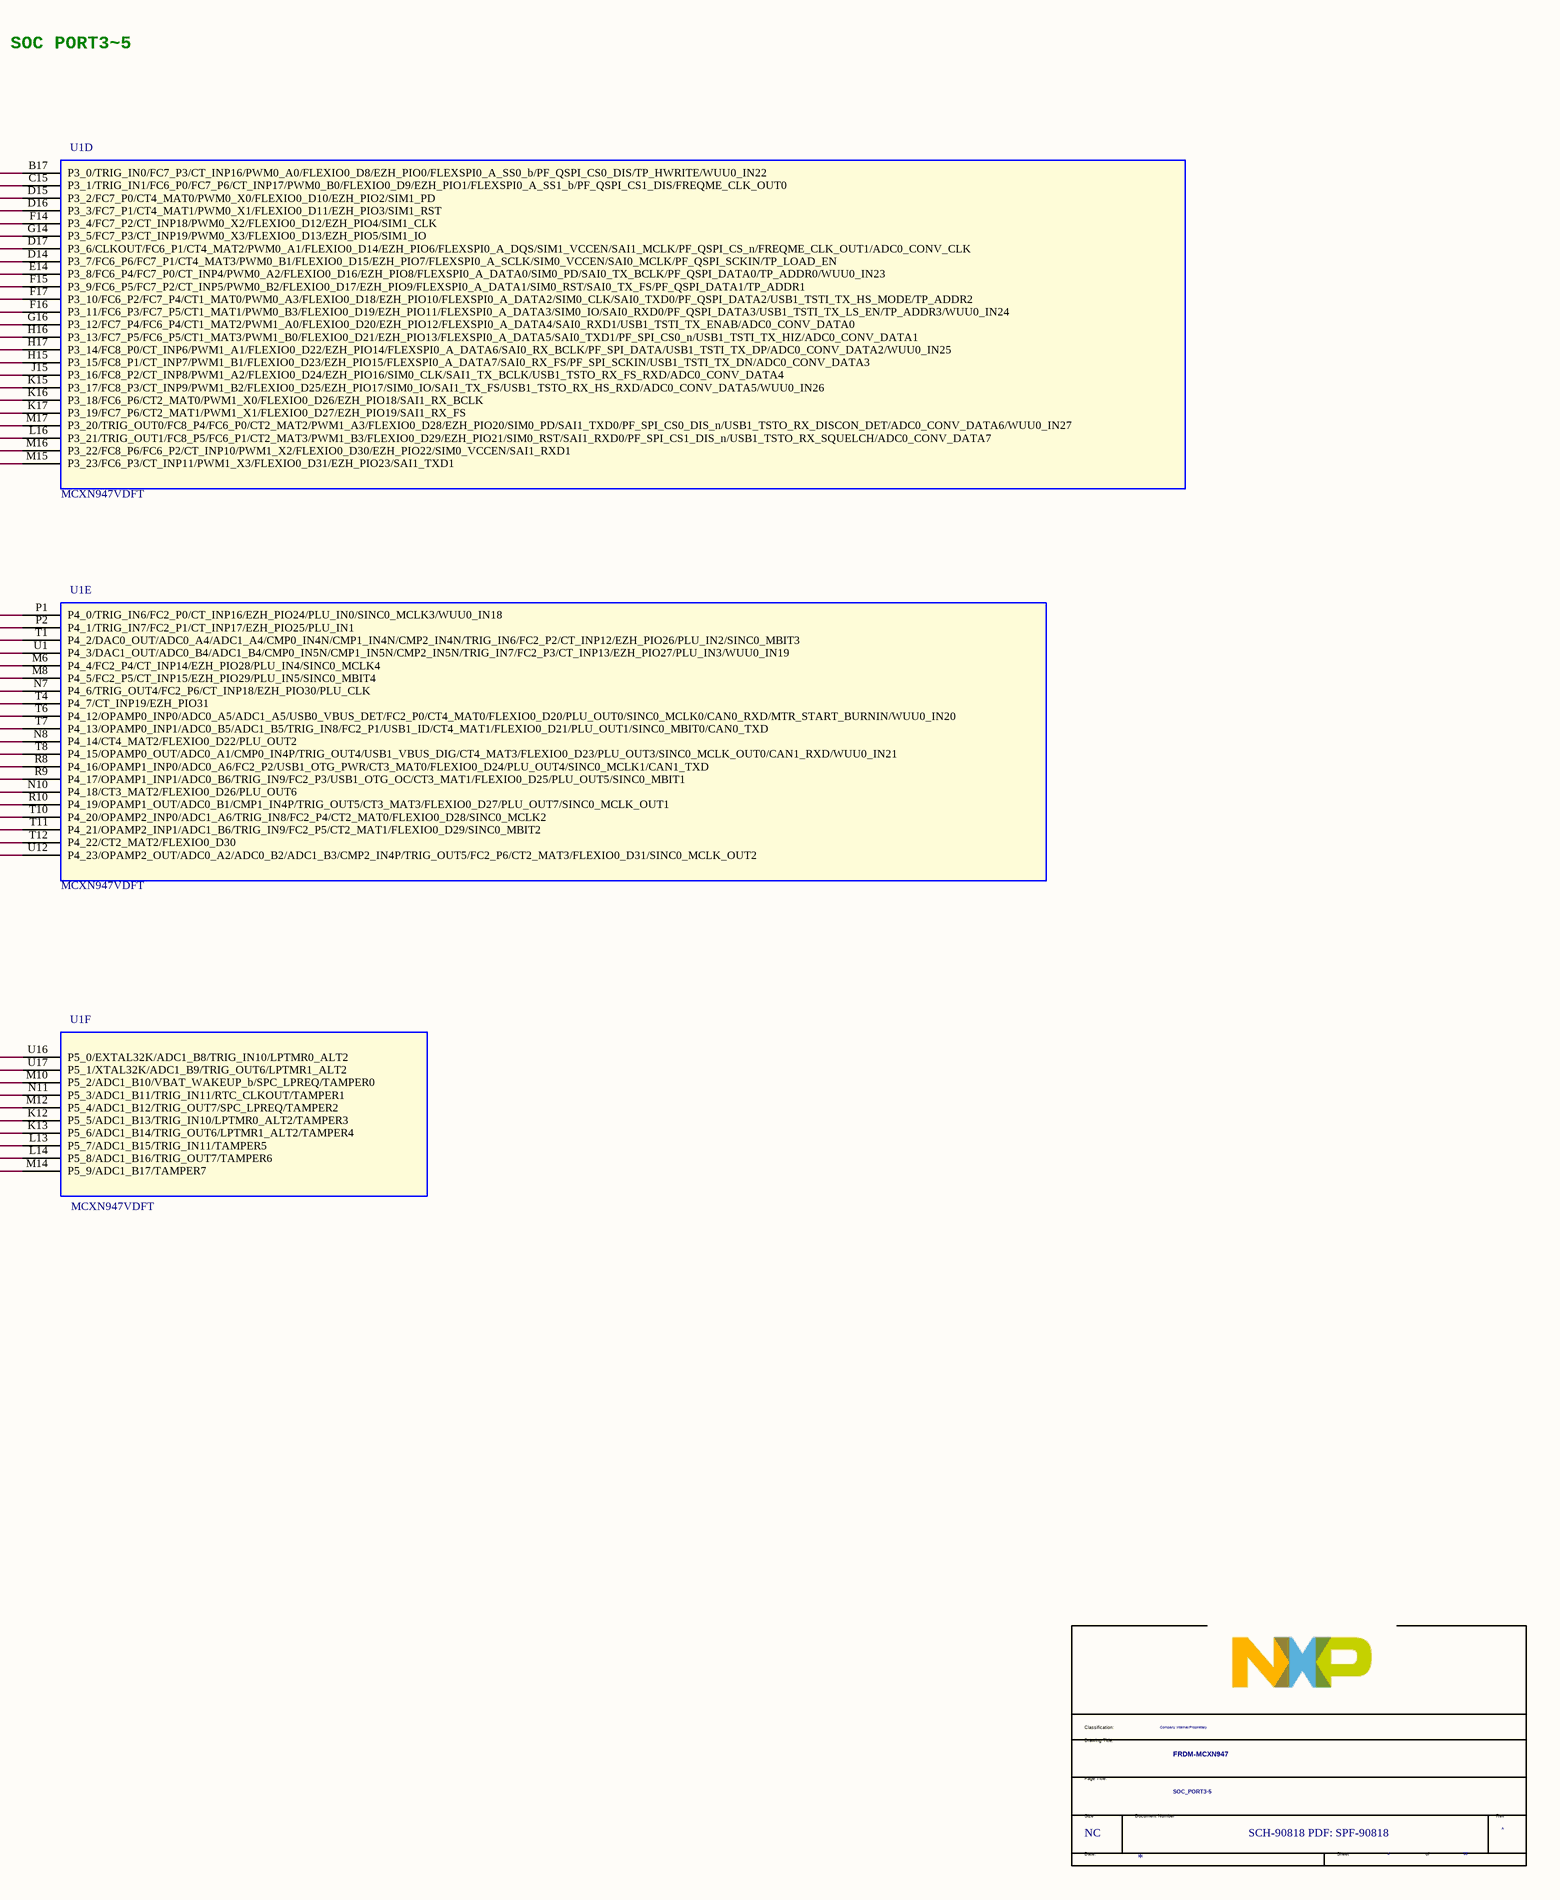
[diagram p3: 04 SOC_PORT3~5.SchDoc, right]

### Parts
(Parts that share a designator on the sheet are numbered #1, #2 ... from top to bottom, then left to right.)
*#2  Doc: SCH-90818 PDF: SPF-90818  RevCode: A  Title: FRDM-MCXN947  Page Size: NC  Page Number: 4  Page Count: 13  PageTitle: SOC_PORT3-5  Classification: Company Internal/Proprietary  (hidden comment: TitleBlock_FS)  (graphical)
C100  4.7pF  [CC0402_25]
C101  4.7pF  [CC0402_25]
R148  4.7K  [RC0402_25]
R149  4.7K  [RC0402_25]
U1  MCXN947VDFT  [bga184_0p5_9x9_sm]  (parts D,E,F of 8)
Y2  32.768KHz  MFG_PN01: 830009678  [XTAL2-3p2x1p5-SM]

### Nets
GND: C100.2 C101.2
P3V3: R148.1 R149.1
EXTAL32K: C100.1 U1.U16(P5_0/EXTAL32K/ADC1_B8/TRIG_IN10/LPTMR0_ALT2) Y2.2
P3_0/FLEXSPI0_A_SS0_b: U1.B17(P3_0/TRIG_IN0/FC7_P3/CT_INP16/PWM0_A0/FLEXIO0_D8/EZH_PIO0/FLEXSPI0_A_SS0_b/PF_QSPI_CS0_DIS/TP_HWRITE/WUU0_IN22) ; off-sheet P3_0/FLEXSPI0_A_SS0_b
P3_1/FLEXSPI0_A_SS1_b: U1.C15(P3_1/TRIG_IN1/FC6_P0/FC7_P6/CT_INP17/PWM0_B0/FLEXIO0_D9/EZH_PIO1/FLEXSPI0_A_SS1_b/PF_QSPI_CS1_DIS/FREQME_CLK_OUT0) ; off-sheet P3_1/FLEXSPI0_A_SS1_b
P3_2/FC7_I2C_SDA: U1.D15(P3_2/FC7_P0/CT4_MAT0/PWM0_X0/FLEXIO0_D10/EZH_PIO2/SIM1_PD) ; off-sheet P3_2/FC7_I2C_SDA
P3_3/FC7_I2C_SCL: U1.D16(P3_3/FC7_P1/CT4_MAT1/PWM0_X1/FLEXIO0_D11/EZH_PIO3/SIM1_RST) ; off-sheet P3_3/FC7_I2C_SCL
P3_4/EZH_LCD_D4_CAMERA_D4: U1.F14(P3_4/FC7_P2/CT_INP18/PWM0_X2/FLEXIO0_D12/EZH_PIO4/SIM1_CLK) ; off-sheet P3_4/EZH_LCD_D4_CAMERA_D4
P3_5/EZH_LCD_D5_CAMERA_D5: U1.G14(P3_5/FC7_P3/CT_INP19/PWM0_X3/FLEXIO0_D13/EZH_PIO5/SIM1_IO) ; off-sheet P3_5/EZH_LCD_D5_CAMERA_D5
P3_6/FLEXSPI0_A_DQS: U1.D17(P3_6/CLKOUT/FC6_P1/CT4_MAT2/PWM0_A1/FLEXIO0_D14/EZH_PIO6/FLEXSPI0_A_DQS/SIM1_VCCEN/SAI1_MCLK/PF_QSPI_CS_n/FREQME_CLK_OUT1/ADC0_CONV_CLK) ; off-sheet P3_6/FLEXSPI0_A_DQS
P3_7/FLEXSPI0_A_SCLK: U1.D14(P3_7/FC6_P6/FC7_P1/CT4_MAT3/PWM0_B1/FLEXIO0_D15/EZH_PIO7/FLEXSPI0_A_SCLK/SIM0_VCCEN/SAI0_MCLK/PF_QSPI_SCKIN/TP_LOAD_EN) ; off-sheet P3_7/FLEXSPI0_A_SCLK
P3_8/FLEXSPI0_A_DATA0: U1.E14(P3_8/FC6_P4/FC7_P0/CT_INP4/PWM0_A2/FLEXIO0_D16/EZH_PIO8/FLEXSPI0_A_DATA0/SIM0_PD/SAI0_TX_BCLK/PF_QSPI_DATA0/TP_ADDR0/WUU0_IN23) ; off-sheet P3_8/FLEXSPI0_A_DATA0
P3_9/FLEXSPI0_A_DATA1: U1.F15(P3_9/FC6_P5/FC7_P2/CT_INP5/PWM0_B2/FLEXIO0_D17/EZH_PIO9/FLEXSPI0_A_DATA1/SIM0_RST/SAI0_TX_FS/PF_QSPI_DATA1/TP_ADDR1) ; off-sheet P3_9/FLEXSPI0_A_DATA1
P3_10/FLEXSPI0_A_DATA2: U1.F17(P3_10/FC6_P2/FC7_P4/CT1_MAT0/PWM0_A3/FLEXIO0_D18/EZH_PIO10/FLEXSPI0_A_DATA2/SIM0_CLK/SAI0_TXD0/PF_QSPI_DATA2/USB1_TSTI_TX_HS_MODE/TP_ADDR2) ; off-sheet P3_10/FLEXSPI0_A_DATA2
P3_11/FLEXSPI0_A_DATA3: U1.F16(P3_11/FC6_P3/FC7_P5/CT1_MAT1/PWM0_B3/FLEXIO0_D19/EZH_PIO11/FLEXSPI0_A_DATA3/SIM0_IO/SAI0_RXD0/PF_QSPI_DATA3/USB1_TSTI_TX_LS_EN/TP_ADDR3/WUU0_IN24) ; off-sheet P3_11/FLEXSPI0_A_DATA3
P3_12/FLEXSPI0_A_DATA4: U1.G16(P3_12/FC7_P4/FC6_P4/CT1_MAT2/PWM1_A0/FLEXIO0_D20/EZH_PIO12/FLEXSPI0_A_DATA4/SAI0_RXD1/USB1_TSTI_TX_ENAB/ADC0_CONV_DATA0) ; off-sheet P3_12/FLEXSPI0_A_DATA4
P3_13/FLEXSPI0_A_DATA5: U1.H16(P3_13/FC7_P5/FC6_P5/CT1_MAT3/PWM1_B0/FLEXIO0_D21/EZH_PIO13/FLEXSPI0_A_DATA5/SAI0_TXD1/PF_SPI_CS0_n/USB1_TSTI_TX_HIZ/ADC0_CONV_DATA1) ; off-sheet P3_13/FLEXSPI0_A_DATA5
P3_14/FLEXSPI0_A_DATA6: U1.H17(P3_14/FC8_P0/CT_INP6/PWM1_A1/FLEXIO0_D22/EZH_PIO14/FLEXSPI0_A_DATA6/SAI0_RX_BCLK/PF_SPI_DATA/USB1_TSTI_TX_DP/ADC0_CONV_DATA2/WUU0_IN25) ; off-sheet P3_14/FLEXSPI0_A_DATA6
P3_15/FLEXSPI0_A_DATA7: U1.H15(P3_15/FC8_P1/CT_INP7/PWM1_B1/FLEXIO0_D23/EZH_PIO15/FLEXSPI0_A_DATA7/SAI0_RX_FS/PF_SPI_SCKIN/USB1_TSTI_TX_DN/ADC0_CONV_DATA3) ; off-sheet P3_15/FLEXSPI0_A_DATA7
P3_16/SAI1_TX_BCLK: U1.J15(P3_16/FC8_P2/CT_INP8/PWM1_A2/FLEXIO0_D24/EZH_PIO16/SIM0_CLK/SAI1_TX_BCLK/USB1_TSTO_RX_FS_RXD/ADC0_CONV_DATA4) ; off-sheet P3_16/SAI1_TX_BCLK
P3_17/SAI1_TX_FS: U1.K15(P3_17/FC8_P3/CT_INP9/PWM1_B2/FLEXIO0_D25/EZH_PIO17/SIM0_IO/SAI1_TX_FS/USB1_TSTO_RX_HS_RXD/ADC0_CONV_DATA5/WUU0_IN26) ; off-sheet P3_17/SAI1_TX_FS
P3_18/SAI1_RX_BCLK: U1.K16(P3_18/FC6_P6/CT2_MAT0/PWM1_X0/FLEXIO0_D26/EZH_PIO18/SAI1_RX_BCLK) ; off-sheet P3_18/SAI1_RX_BCLK
P3_19: U1.K17(P3_19/FC7_P6/CT2_MAT1/PWM1_X1/FLEXIO0_D27/EZH_PIO19/SAI1_RX_FS) ; off-sheet P3_19/ME_PWM, off-sheet P3_19/SAI1_RX_FS  [also labelled P3_19/ME_PWM, P3_19/SAI1_RX_FS]
P3_20: U1.M17(P3_20/TRIG_OUT0/FC8_P4/FC6_P0/CT2_MAT2/PWM1_A3/FLEXIO0_D28/EZH_PIO20/SIM0_PD/SAI1_TXD0/PF_SPI_CS0_DIS_n/USB1_TSTO_RX_DISCON_DET/ADC0_CONV_DATA6/WUU0_IN27) ; off-sheet P3_20/ME_FC6_SPI_MOSI, off-sheet P3_20/SAI1_TXD0  [also labelled P3_20/ME_FC6_SPI_MOSI, P3_20/SAI1_TXD0]
P3_21: U1.L16(P3_21/TRIG_OUT1/FC8_P5/FC6_P1/CT2_MAT3/PWM1_B3/FLEXIO0_D29/EZH_PIO21/SIM0_RST/SAI1_RXD0/PF_SPI_CS1_DIS_n/USB1_TSTO_RX_SQUELCH/ADC0_CONV_DATA7) ; off-sheet P3_21/ME_FC6_SPI_CLK, off-sheet P3_21/SAI1_RXD0  [also labelled P3_21/ME_FC6_SPI_CLK, P3_21/SAI1_RXD0]
P3_22/ME_FC6_SPI_MISO: U1.M16(P3_22/FC8_P6/FC6_P2/CT_INP10/PWM1_X2/FLEXIO0_D30/EZH_PIO22/SIM0_VCCEN/SAI1_RXD1) ; off-sheet P3_22/ME_FC6_SPI_MISO
P3_23/ME_FC6_SPI_CS: U1.M15(P3_23/FC6_P3/CT_INP11/PWM1_X3/FLEXIO0_D31/EZH_PIO23/SAI1_TXD1) ; off-sheet P3_23/ME_FC6_SPI_CS
P4_0: R148.2 U1.P1(P4_0/TRIG_IN6/FC2_P0/CT_INP16/EZH_PIO24/PLU_IN0/SINC0_MCLK3/WUU0_IN18) ; off-sheet P4_0/FC2_I2C_SDA-FXIO_HDR, off-sheet P4_0/FC2_I2C_SDA-ARD_D18, off-sheet P4_0/FC2_I2C_SDA-MCULINK  [also labelled P4_0/FC2_I2C_SDA-ARD_D18, P4_0/FC2_I2C_SDA-FXIO_HDR, P4_0/FC2_I2C_SDA-MCULINK]
P4_1: R149.2 U1.P2(P4_1/TRIG_IN7/FC2_P1/CT_INP17/EZH_PIO25/PLU_IN1) ; off-sheet P4_1/FC2_I2C_SCL-FXIO_HDR, off-sheet P4_1/FC2_I2C_SCL-ARD_D19, off-sheet P4_1/FC2_I2C_SCL-MCULINK  [also labelled P4_1/FC2_I2C_SCL-ARD_D19, P4_1/FC2_I2C_SCL-FXIO_HDR, P4_1/FC2_I2C_SCL-MCULINK]
P4_2: U1.T1(P4_2/DAC0_OUT/ADC0_A4/ADC1_A4/CMP0_IN4N/CMP1_IN4N/CMP2_IN4N/TRIG_IN6/FC2_P2/CT_INP12/EZH_PIO26/PLU_IN2/SINC0_MBIT3) ; off-sheet P4_2/FC2_P2_UART_TXD_MCULINK, off-sheet P4_2/FC2_UART_TXD-ARD_D1  [also labelled P4_2/FC2_P2_UART_TXD_MCULINK, P4_2/FC2_UART_TXD-ARD_D1]
P4_3: U1.U1(P4_3/DAC1_OUT/ADC0_B4/ADC1_B4/CMP0_IN5N/CMP1_IN5N/CMP2_IN5N/TRIG_IN7/FC2_P3/CT_INP13/EZH_PIO27/PLU_IN3/WUU0_IN19) ; off-sheet P4_3/FC2_P3_UART_TXD_MCULINK, off-sheet P4_3/FC2_UART_RXD-ARD_D0  [also labelled P4_3/FC2_P3_UART_TXD_MCULINK, P4_3/FC2_UART_RXD-ARD_D0]
P4_4/EZH_LCD_CS: U1.M6(P4_4/FC2_P4/CT_INP14/EZH_PIO28/PLU_IN4/SINC0_MCLK4) ; off-sheet P4_4/EZH_LCD_CS
P4_5: U1.M8(P4_5/FC2_P5/CT_INP15/EZH_PIO29/PLU_IN5/SINC0_MBIT4) ; off-sheet P4_5/SINC0_MBIT4-HDR, off-sheet P4_5/FXIO_LCD_GPIO  [also labelled P4_5/FXIO_LCD_GPIO, P4_5/SINC0_MBIT4-HDR]
P4_6/FXIO_LCD_INT: U1.N7(P4_6/TRIG_OUT4/FC2_P6/CT_INP18/EZH_PIO30/PLU_CLK) ; off-sheet P4_6/FXIO_LCD_INT
P4_7/FXIO_LCD_RST: U1.T4(P4_7/CT_INP19/EZH_PIO31) ; off-sheet P4_7/FXIO_LCD_RST
P4_12: U1.T6(P4_12/OPAMP0_INP0/ADC0_A5/ADC1_A5/USB0_VBUS_DET/FC2_P0/CT4_MAT0/FLEXIO0_D20/PLU_OUT0/SINC0_MCLK0/CAN0_RXD/MTR_START_BURNIN/WUU0_IN20) ; off-sheet P4_12/RSHUNT_CURA_P, off-sheet P4_12/FXIO_D20  [also labelled P4_12/FXIO_D20, P4_12/RSHUNT_CURA_P]
P4_13: U1.T7(P4_13/OPAMP0_INP1/ADC0_B5/ADC1_B5/TRIG_IN8/FC2_P1/USB1_ID/CT4_MAT1/FLEXIO0_D21/PLU_OUT1/SINC0_MBIT0/CAN0_TXD) ; off-sheet P4_13/MC_ENC_I, off-sheet P4_13/FXIO_D21  [also labelled P4_13/FXIO_D21, P4_13/MC_ENC_I]
P4_14/FXIO_D22: U1.N8(P4_14/CT4_MAT2/FLEXIO0_D22/PLU_OUT2) ; off-sheet P4_14/FXIO_D22
P4_15/FXIO_D23: U1.T8(P4_15/OPAMP0_OUT/ADC0_A1/CMP0_IN4P/TRIG_OUT4/USB1_VBUS_DIG/CT4_MAT3/FLEXIO0_D23/PLU_OUT3/SINC0_MCLK_OUT0/CAN1_RXD/WUU0_IN21) ; off-sheet P4_15/FXIO_D23
P4_16: U1.R8(P4_16/OPAMP1_INP0/ADC0_A6/FC2_P2/USB1_OTG_PWR/CT3_MAT0/FLEXIO0_D24/PLU_OUT4/SINC0_MCLK1/CAN1_TXD) ; off-sheet P4_16/RSHUNT_CURB_P, off-sheet P4_16/FXIO_D24, off-sheet P4_16/USB1_OTG_PWR  [also labelled P4_16/FXIO_D24, P4_16/RSHUNT_CURB_P, P4_16/USB1_OTG_PWR]
P4_17: U1.R9(P4_17/OPAMP1_INP1/ADC0_B6/TRIG_IN9/FC2_P3/USB1_OTG_OC/CT3_MAT1/FLEXIO0_D25/PLU_OUT5/SINC0_MBIT1) ; off-sheet P4_17/FXIO_D25, off-sheet P4_17/USB1_OTG_OC  [also labelled P4_17/FXIO_D25, P4_17/USB1_OTG_OC]
P4_18/FXIO_D26: U1.N10(P4_18/CT3_MAT2/FLEXIO0_D26/PLU_OUT6) ; off-sheet P4_18/FXIO_D26
P4_19/FXIO_D27: U1.R10(P4_19/OPAMP1_OUT/ADC0_B1/CMP1_IN4P/TRIG_OUT5/CT3_MAT3/FLEXIO0_D27/PLU_OUT7/SINC0_MCLK_OUT1) ; off-sheet P4_19/FXIO_D27
P4_20: U1.T10(P4_20/OPAMP2_INP0/ADC1_A6/TRIG_IN8/FC2_P4/CT2_MAT0/FLEXIO0_D28/SINC0_MCLK2) ; off-sheet P4_20/RSHUNT_CURC_P, off-sheet P4_20/FXIO_D28  [also labelled P4_20/FXIO_D28, P4_20/RSHUNT_CURC_P]
P4_21/FXIO_D29: U1.T11(P4_21/OPAMP2_INP1/ADC1_B6/TRIG_IN9/FC2_P5/CT2_MAT1/FLEXIO0_D29/SINC0_MBIT2) ; off-sheet P4_21/FXIO_D29
P4_22/FXIO_D30: U1.T12(P4_22/CT2_MAT2/FLEXIO0_D30) ; off-sheet P4_22/FXIO_D30
P4_23/FXIO_D31: U1.U12(P4_23/OPAMP2_OUT/ADC0_A2/ADC0_B2/ADC1_B3/CMP2_IN4P/TRIG_OUT5/FC2_P6/CT2_MAT3/FLEXIO0_D31/SINC0_MCLK_OUT2) ; off-sheet P4_23/FXIO_D31
P5_2/MC_BEMF_B: U1.M10(P5_2/ADC1_B10/VBAT_WAKEUP_b/SPC_LPREQ/TAMPER0) ; off-sheet P5_2/MC_BEMF_B
P5_3/MC_BEMF_C: U1.N11(P5_3/ADC1_B11/TRIG_IN11/RTC_CLKOUT/TAMPER1) ; off-sheet P5_3/MC_BEMF_C
P5_4/MC_VOLT_DCB: U1.M12(P5_4/ADC1_B12/TRIG_OUT7/SPC_LPREQ/TAMPER2) ; off-sheet P5_4/MC_VOLT_DCB
P5_5/MC_CUR_DCB: U1.K12(P5_5/ADC1_B13/TRIG_IN10/LPTMR0_ALT2/TAMPER3) ; off-sheet P5_5/MC_CUR_DCB
P5_6/PMOD_RESET: U1.K13(P5_6/ADC1_B14/TRIG_OUT6/LPTMR1_ALT2/TAMPER4) ; off-sheet P5_6/PMOD_RESET
P5_7/ME_INT: U1.L13(P5_7/ADC1_B15/TRIG_IN11/TAMPER5) ; off-sheet P5_7/ME_INT
P5_8: U1.L14(P5_8/ADC1_B16/TRIG_OUT7/TAMPER6) ; off-sheet P5_8
P5_9: U1.M14(P5_9/ADC1_B17/TAMPER7) ; off-sheet P5_9
XTAL32K: C101.1 U1.U17(P5_1/XTAL32K/ADC1_B9/TRIG_OUT6/LPTMR1_ALT2) Y2.1

### Notes on the sheet
- SOC PORT3~5
- (in symbol TitleBlock_FS) Classification:; Drawing Title:; Page Title:; Size; Document Number; Rev; Date:; Sheet; of

### Library data of the parts
*#2 = TitleBlock_FS: Classification: Public, Company Internal/Proprietary, Company Confidential,  Company Secret; Variant Name: <Core Design>; OrgAddr2: Austin, TX 78735-8598; OrgAddr1: 6501 William Cannon Drive West; OrgName: NXP Semiconductors; Page Create Date: March  8, 1995; Page Modify Date: *
C100 C101 = CAP_NP: as C1 on sheet 03 SOC_PORT0~2; PCB Footprint: CC0402_25; ROHS: yes; Rated Voltage: 50V; Tolerance: 0.5pF; Package Type: SMD/SMT; HEIGHT: 0.5 mm; Package Size: 0402 (1005 metric)
R148 = RES: RES MF 4.7K 1/16W 5% 0402; CLASS: DISCRETE; Pkg: 0402; AGILE_PN: 470-75626; FPLIST: RC0402_25,RC0402_HD,0402_CC,RC0402_X2; CAD_APPROVED: Yes; MFG_NAME01: BOURNS; MFG_PN01: CR0402-JW-472GLF; PCB Footprint: RC0402_25; HEIGHT: 0.41mm; Tolerance: 5%; ROHS: Yes
R149 = RES: RES MF 4.7K 1/16W 5% 0402; CLASS: DISCRETE; MFG_PN01: CR0402-JW-472GLF; MFG_NAME01: BOURNS; CAD_APPROVED: Yes; FPLIST: RC0402_25,RC0402_HD,0402_CC,RC0402_X2; AGILE_PN: 470-75626; Pkg: 0402; PCB Footprint: RC0402_25; ROHS: Yes; Tolerance: 5%; HEIGHT: 0.41mm
U1 = MCXN947VDFT_BGA_184P: IC MCU LOW POWER 150MHz ARM Nirvana -- VFBGA184; SPLIT_INST: TRUE; AGILE_PN: TMP-CIP-10342; CAD_APPROVED: Yes; PRE_APN: 344-02549; Temp Range: -40  ¡ãC to +105 ¡ãC; MFG_NAME01: NXP SEMICONDUCTOR; CLASS: IC; Package Size: 9x9; HEIGHT: 0.98 MM; ROHS: Yes; MFG_PN01: MCXN947VDFT; 3D_Mechanical_Footprint_File: http://fcl.am.freescale.net/ALLEGRO/step/bga184_0p5_9x9_sm.STEP; PCB Footprint: bga184_0p5_9x9_sm
Y2 = CRYSTAL: XTAL 32.768kHz 12.5pF 1.05pF 20ppm SMT; CLASS: IC; MFG_NAME01: Wurth Electronics Inc.; CAD_APPROVED: Yes; AGILE_PN: 230-78676; 3D_Mechanical_Footprint_File: http://fcl.am.freescale.net/ALLEGRO/step/xtal2-3p2x1p5-sm.step; ROHS: Yes; HEIGHT: 0.9 MM; PCB Footprint: XTAL2-3p2x1p5-SM

## Sheet 06 USB & PWR.SchDoc
size 513 x 386 mm
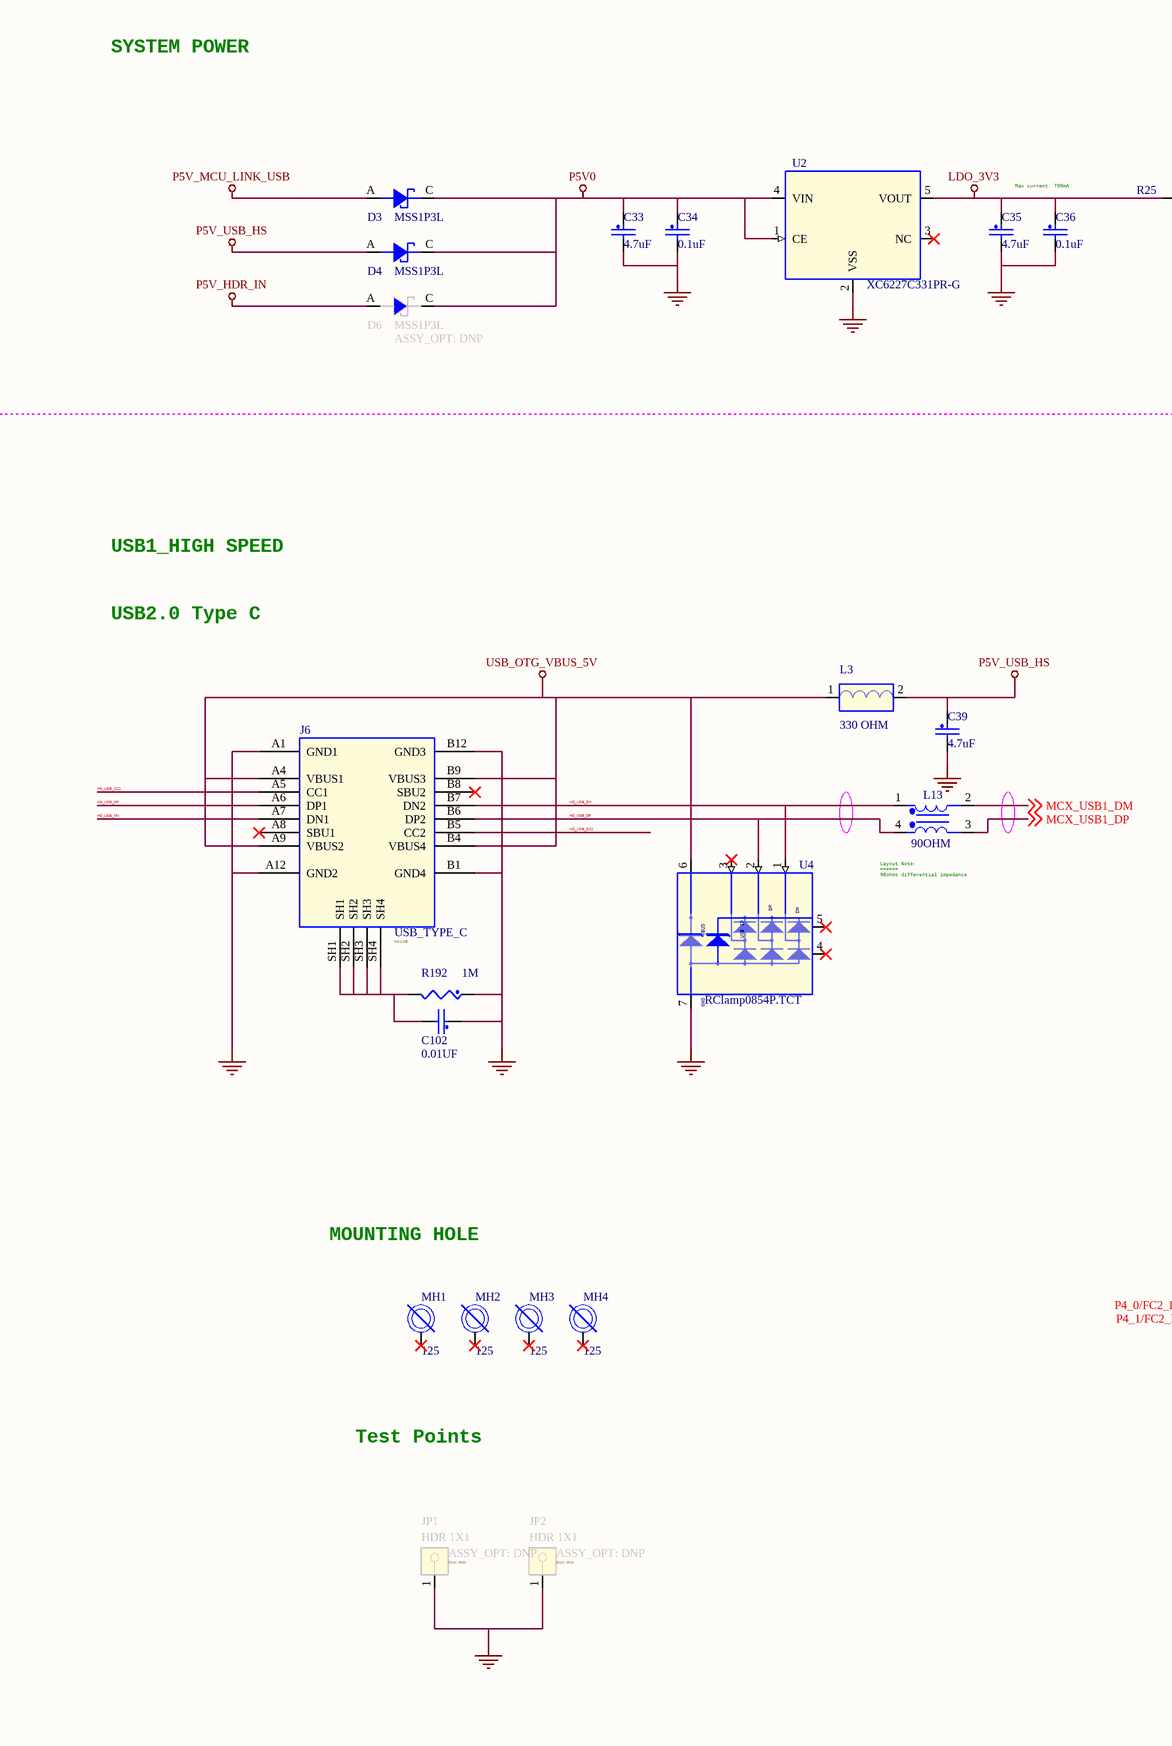
[diagram p4: 06 USB & PWR.SchDoc, left]
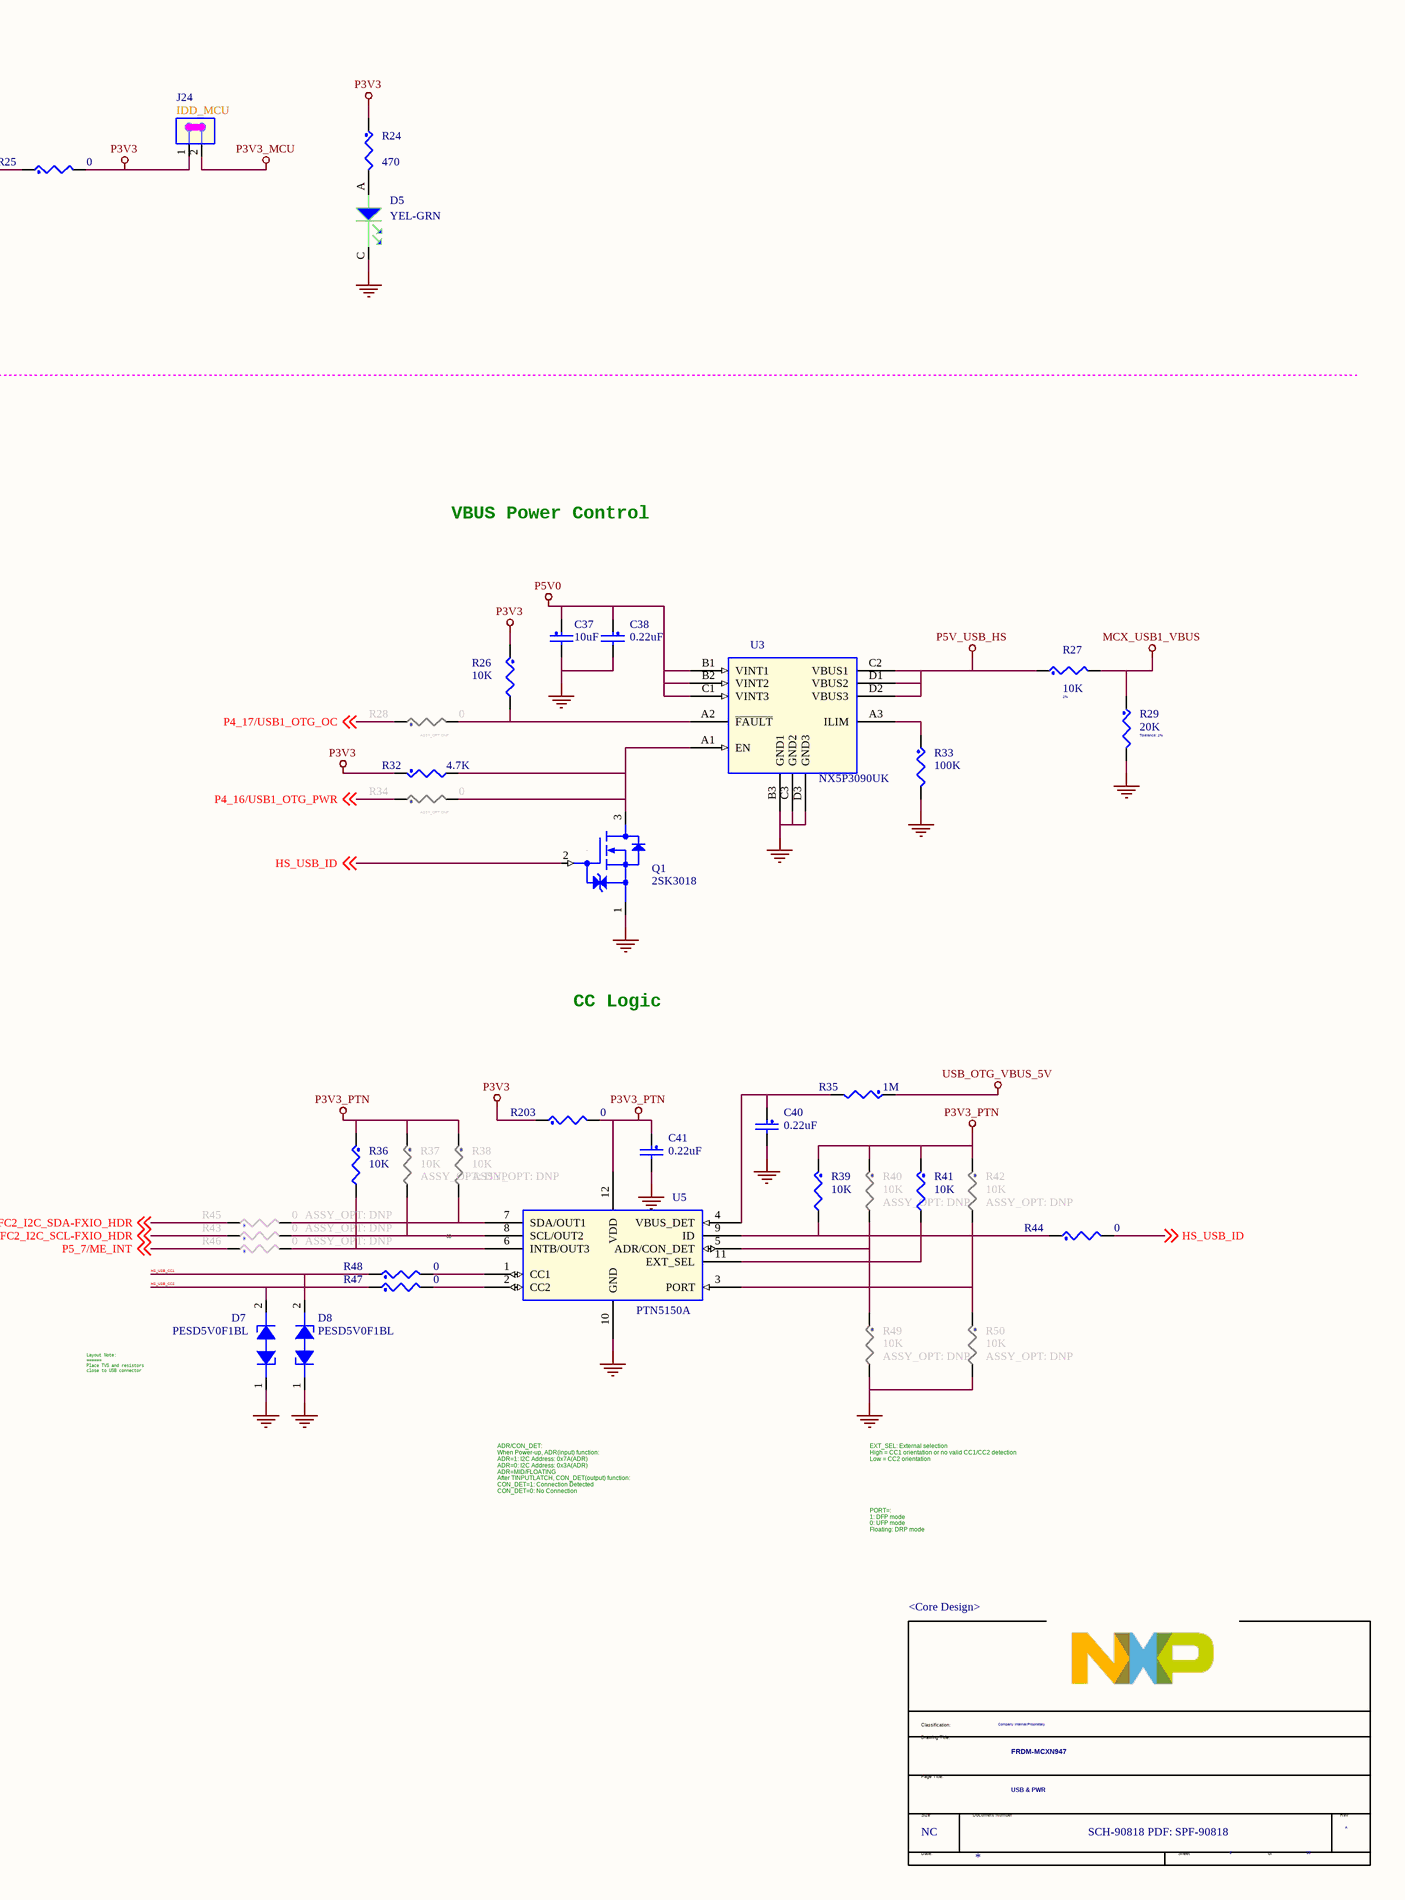
[diagram p5: 06 USB & PWR.SchDoc, right]

### Parts
(Parts that share a designator on the sheet are numbered #1, #2 ... from top to bottom, then left to right.)
*#3  Doc: SCH-90818 PDF: SPF-90818  RevCode: A  Title: FRDM-MCXN947  Page Size: NC  Page Number: 6  Page Count: 13  PageTitle: USB & PWR  Variant Name: <Core Design>  Classification: Company Internal/Proprietary  (hidden comment: TitleBlock_FS)  (graphical)
C33  4.7uF  [CC0603_OV]
C34  0.1uF  [CC0402_25]
C35  4.7uF  [CC0603_OV]
C36  0.1uF  [CC0402_25]
C37  10uF  [CC0603_OV]
C38  0.22uF  [CC0402_25]
C39  4.7uF  [CC0603_OV]
C40  0.22uF  [CC0402_25]
C41  0.22uF  [CC0402_25]
C102  0.01UF  [CC0805_OV]
D3  MSS1P3L  [smb_2p7x1p4]
D4  MSS1P3L  [smb_2p7x1p4]
D5  YEL-GRN  [led_1x0p6_sm]
D6  MSS1P3L  ASSY_OPT: DNP  [smb_2p7x1p4]
D7  PESD5V0F1BL  [sod882]
D8  PESD5V0F1BL  [sod882]
J6  USB_TYPE_C  SILK: HS-USB  [con16_usb_type-c_ra_th]
J24  SILK: IDD_MCU  [hdr1x2_5p48x2p69]  (hidden comment: HDR1X2)
JP1  HDR 1X1  ASSY_OPT: DNP  SILK: GND  [HDR101]
JP2  HDR 1X1  ASSY_OPT: DNP  SILK: GND  [HDR101]
L3  330 OHM  [ind_1608]
L13  90OHM  [ind4_choke_0805_39h]
MH1  125  [MH125-160]
MH2  125  [MH125-160]
MH3  125  [MH125-160]
MH4  125  [MH125-160]
Q1  2SK3018  [SOT323_3]
R24  470  [RC0402_25]
R25  0  [RC0603_OV]
R26  10K  [RC0402_25]
R27  10K  Tolerance: 1%  [RC0402_25]
R28  0  ASSY_OPT: DNP  [RC0603_OV]
R29  20K  Tolerance: 1%  [RC0402_25]
R32  4.7K  [RC0402_25]
R33  100K  [RC0402_25]
R34  0  ASSY_OPT: DNP  [RC0603_OV]
R35  1M  [RC0805_OV]
R36  10K  [RC0402_25]
R37  10K  ASSY_OPT: DNP  [RC0402_25]
R38  10K  ASSY_OPT: DNP  [RC0402_25]
R39  10K  [RC0402_25]
R40  10K  ASSY_OPT: DNP  [RC0402_25]
R41  10K  [RC0402_25]
R42  10K  ASSY_OPT: DNP  [RC0402_25]
R43  0  ASSY_OPT: DNP  [RC0402_25]
R44  0  [RC0603_OV]
R45  0  ASSY_OPT: DNP  [RC0402_25]
R46  0  ASSY_OPT: DNP  [RC0402_25]
R47  0  [RC0402_25]
R48  0  [RC0402_25]
R49  10K  ASSY_OPT: DNP  [RC0402_25]
R50  10K  ASSY_OPT: DNP  [RC0402_25]
R192  1M  [RC0805_OV]
R203  0  [RC0402_25]
U2  XC6227C331PR-G  [SOT89-5]
U3  NX5P3090UK  [wlcsp12_0p4_1p38x1p68mm_smdp]
U4  RClamp0854P.TCT  [slp1616p6]
U5  PTN5150A  [x2qfn12_0p4_1p6x1p6]

### Nets
GND: C33.2 C34.2 C35.2 C36.2 C37.2 C38.2 C39.2 C40.2 C41.2 C102.1 D5.C(CATHODE) D7.1(C1) D8.1(C1) J6.A1(GND1) J6.A12(GND2) J6.B1(GND4) J6.B12(GND3) JP1.1 JP2.1 Q1.1(SOURCE) R29.2 R33.2 R49.2 R50.2 R192.1 U2.2(VSS) U3.B3(GND1) U3.C3(GND2) U3.D3(GND3) U4.7(GND) U5.10(GND)
LDO_3V3: C35.1 C36.1 R25.1 U2.5(VOUT)
MCX_USB1_VBUS: R27.2 R29.1
P3V3: J24.1 R24.1 R25.2 R26.1 R32.1 R203.1
P3V3_MCU: J24.2
P3V3_PTN: C41.1 R36.1 R37.1 R38.1 R39.1 R40.1 R41.1 R42.1 R203.2 U5.12(VDD)
P5V0: C33.1 C34.1 C37.1 C38.1 D3.C D4.C D6.C U2.1(CE) U2.4(VIN) U3.B1(VINT1) U3.B2(VINT2) U3.C1(VINT3)
P5V_HDR_IN: D6.A
P5V_MCU_LINK_USB: D3.A
P5V_USB_HS: C39.1 D4.A L3.2 R27.1 U3.C2(VBUS1) U3.D1(VBUS2) U3.D2(VBUS3)
USB_OTG_VBUS_5V: J6.A4(VBUS1) J6.A9(VBUS2) J6.B4(VBUS4) J6.B9(VBUS3) L3.1 R35.1 U4.6(VBUS)
HS_USB_CC1: D8.2(C2) J6.A5(CC1) R48.1
HS_USB_CC2: D7.2(C2) J6.B5(CC2) R47.1
HS_USB_DN: J6.A7(DN1) J6.B7(DN2) L13.1 U4.1(DM)
HS_USB_DP: J6.A6(DP1) J6.B6(DP2) L13.4 U4.2(DP)
HS_USB_ID: Q1.2(GATE) R44.2 ; off-sheet HS_USB_ID
MCX_USB1_DM: L13.2 ; off-sheet MCX_USB1_DM
MCX_USB1_DP: L13.3 ; off-sheet MCX_USB1_DP
P4_0/FC2_I2C_SDA-FXIO_HDR: R45.1 ; off-sheet P4_0/FC2_I2C_SDA-FXIO_HDR  [project net P4_0]
P4_1/FC2_I2C_SCL-FXIO_HDR: R43.1 ; off-sheet P4_1/FC2_I2C_SCL-FXIO_HDR  [project net P4_1]
P4_16/USB1_OTG_PWR: R34.1 ; off-sheet P4_16/USB1_OTG_PWR  [project net P4_16]
P4_17/USB1_OTG_OC: R28.1 ; off-sheet P4_17/USB1_OTG_OC  [project net P4_17]
P5_7/ME_INT: R46.1 ; off-sheet P5_7/ME_INT
NetC40_1: C40.1 R35.2 U5.4(VBUS_DET)
NetC102_2: C102.2 J6.SH1 J6.SH2 J6.SH3 J6.SH4 R192.2
NetD5_A: D5.A(ANODE) R24.2
NetQ1_3: Q1.3(DRAIN) R32.2 R34.2 U3.A1(EN)
NetR26_2: R26.2 R28.2 U3.A2(~{FAULT})
NetR33_1: R33.1 U3.A3(ILIM)
NetR36_2: R36.2 R46.2 U5.6(INTB/OUT3)
NetR37_2: R37.2 R43.2 U5.8(SCL/OUT2)
NetR38_2: R38.2 R45.2 U5.7(SDA/OUT1)
NetR39_2: R39.2 R44.1 U5.9(ID)
NetR40_2: R40.2 R49.1 U5.5(ADR/CON_DET)
NetR41_2: R41.2 U5.11(EXT_SEL)
NetR42_2: R42.2 R50.1 U5.3(PORT)
NetR47_2: R47.2 U5.2(CC2)
NetR48_2: R48.2 U5.1(CC1)

Not connected (* = marked no-connect by the designer): J6 A8(SBU1)* B8(SBU2)*; MH1 1*; MH2 1*; MH3 1*; MH4 1*; U2 3(NC)*; U4 3(USB_ID)* 4(NC1)* 5(NC2)*

### Notes on the sheet
- SYSTEM POWER
- Max current: 700mA
- USB1_HIGH SPEED
- VBUS Power Control
- USB2.0 Type C
- (near L13) Layout Note:
  ======
  90ohms differential impedance
- CC Logic
- MOUNTING HOLE
- OD
- Test Points
- (near D7) Layout Note:
  ======
  Place TVS and resistors
  close to USB connector
- ADR/CON_DET:
  When Power-up, ADR(input) function:
  ADR=1: I2C Address: 0x7A(ADR)
  ADR=0: I2C Address: 0x3A(ADR)
  ADR=MID/FLOATING
  After TINPUTLATCH, CON_DET(output) function:
  CON_DET=1: Connection Detected
  CON_DET=0: No Connection
- EXT_SEL: External selection
  High = CC1 orientation or no valid CC1/CC2 detection
  Low = CC2 orientation
- PORT=:
  1: DFP mode
  0: UFP mode
  Floating: DRP mode
- (in symbol TitleBlock_FS) Classification:; Drawing Title:; Page Title:; Size; Document Number; Rev; Date:; Sheet; of

### Library data of the parts
*#3 = TitleBlock_FS: Classification: Public, Company Internal/Proprietary, Company Confidential,  Company Secret; OrgName: NXP Semiconductors; OrgAddr1: 6501 William Cannon Drive West; OrgAddr2: Austin, TX 78735-8598; Page Create Date: March  8, 1995; Page Modify Date: *
C33 C35 = CAP_NP: CAP CER 4.7uF 10V 20% X5R 0603; CLASS: DISCRETE; Temp Range: -55C TO 85C; TOL: 10%; FPLIST: CC0603_OV,CC0603,0603_CC; CAD_APPROVED: Yes; MFG_PN01: 885012106012; MFG_NAME01: WURTH ELEKTRONIK; AGILE_PN: 150-81893; ROOM: CPU; SIGNAL_MODEL: DEFAULT_CAPACITOR_220000pF_2_1; 3D_Mechanical_Footprint_File: http://fcl.am.freescale.net/ALLEGRO/step/cc0603_ov.STEP; Rated Voltage: 10V; Package Type: WCAP-CSGP_0603; Package Size: 0603; VOLTAGE: 10V; WVDC: 10V; HEIGHT: 0.87MM; ROHS: Yes; Tolerance: 20%; PCB Footprint: CC0603_OV
C34 C36 = CAP_NP: CAP CER 0.1UF 16V 10% X7R 0402; CLASS: DISCRETE; SIGNAL_MODEL: DEFAULT_CAPACITOR_100000pF_2_1; AGILE_PN: 150-75182; MFG_NAME01: Samsung Electro-Mechanics; MFG_PN01: CL05B104KO5NNNC; CAD_APPROVED: Yes; FPLIST: CC0402_25,CC0402_HD,0402_CC,CAPC0402_L,cc0402_lamp3; Temp_Range: -55°C to +85°C; Temp Range: -55C to +125C; Tolerance: 10%; ROHS: Yes; HEIGHT: 0.635MM; VOLTAGE: 16V; Rated Voltage: 16V; 3D_Mechanical_Footprint_File: http://fcl.am.freescale.net/ALLEGRO/step/cc0402_25.STEP; PCB Footprint: CC0402_25
C37 = CAP_NP: CAP CER 10uF 25V 10% X5R 0603; CLASS: DISCRETE; AGILE_PN: 150-79569; CAD_APPROVED: Yes; MFG_NAME01: SANYEAR; MFG_PN01: C0603X5R106K250NT; Package Size: 0603 [1608 Metric]; HEIGHT: 1MM; Package Type: SMD/SMT; Tolerance: 10%; Rated Voltage: 25V; ROHS: Yes; 3D_Mechanical_Footprint_File: http://fcl.am.freescale.net/ALLEGRO/step/cc0603_ov.STEP; PCB Footprint: CC0603_OV
C38 C40 = CAP_NP: CAP CER 0.22UF 16V 10% X7R 0402; CLASS: DISCRETE; Temp Range: -55C to +125C; FPLIST: CC0402_25,CC0402_HD,0402_CC; CAD_APPROVED: Yes; MFG_PN01: 0402B224K160NT; MFG_NAME01: FENGHUA; AGILE_PN: 150-78886; PCB Footprint: CC0402_25; 3D_Mechanical_Footprint_File: http://fcl.am.freescale.net/ALLEGRO/step/cc0402_25.STEP; Rated Voltage: 16V; Package Type: SMD/SMT; Package Size: 0402 [1005 Metric]; VOLTAGE: 16V; HEIGHT: 0.55MM; ROHS: Yes; Tolerance: 10%
C39 = CAP_NP: CAP CER 4.7uF 10V 20% X5R 0603; CLASS: DISCRETE; Temp Range: -55C TO 85C; FPLIST: CC0603_OV,CC0603,0603_CC; CAD_APPROVED: Yes; MFG_PN01: 885012106012; MFG_NAME01: WURTH ELEKTRONIK; AGILE_PN: 150-81893; 3D_Mechanical_Footprint_File: http://fcl.am.freescale.net/ALLEGRO/step/cc0603_ov.STEP; Rated Voltage: 10V; Package Type: WCAP-CSGP_0603; Package Size: 0603; HEIGHT: 0.87MM; ROHS: Yes; Tolerance: 20%; VOLTAGE: 10V; TOL: 20%; PCB Footprint: CC0603_OV
C41 = CAP_NP: CAP CER 0.22UF 16V 10% X7R 0402; CLASS: DISCRETE; AGILE_PN: 150-78886; MFG_NAME01: FENGHUA; MFG_PN01: 0402B224K160NT; CAD_APPROVED: Yes; FPLIST: CC0402_25,CC0402_HD,0402_CC; Temp Range: -55C to +125C; Tolerance: 10%; ROHS: Yes; HEIGHT: 0.55MM; VOLTAGE: 16V; Package Size: 0402 [1005 Metric]; Package Type: SMD/SMT; Rated Voltage: 16V; 3D_Mechanical_Footprint_File: http://fcl.am.freescale.net/ALLEGRO/step/cc0402_25.STEP; PCB Footprint: CC0402_25
C102 = CAP_NP: CAP CER 0.01UF 50V 10% X7R 0805; CLASS: DISCRETE; AGILE_PN: 150-75010; FPLIST: CC0805_OV,CC0805,0805_CC; CAD_APPROVED: Yes; Temp Range: -55C to +125C; MFG_NAME01: VENKEL COMPANY; MFG_PN01: C0805X7R500-103KNE; Package Size: 0805; HEIGHT: 1.4732 MM; Tolerance: 10%; Rated Voltage: 50V; ROHS: Yes; PCB Footprint: CC0805_OV
D3 D4 = DIODE_SCHTKY: DIODE SCH 1A 30V MICROSMP SMT; CLASS: IC; AGILE_PN: 480-76978; CAD_APPROVED: Yes; MFG_NAME01: VISHAY INTERTECHNOLOGY; MFG_PN01: MSS1P3L-M3/89A; HEIGHT: 0.73MM; Rated Voltage: 30V; 3D_Mechanical_Footprint_File: http://fcl.am.freescale.net/ALLEGRO/step/smb_2p7x1p4.step; PCB Footprint: smb_2p7x1p4
D5 = LED: LED YEL-GRN SGL 25mA SMT 0402; CLASS: IC; MFG_PN01: MHT136CGCT; MFG_NAME01: Lianyungang Meihua Electronics Technology Co.,Ltd; Temp Range: -35¡ãC to +85¡ãC; VOLTAGE: 1.7-2.2V@5mA; CAD_APPROVED: YES; AGILE_PN: 370-76900; PCB Footprint: led_1x0p6_sm; Rated Voltage: 1.7-2.2V@5mA; HEIGHT: 0.35MM; Package Size: 1 x 0.5 x 0.3 mm
D6 = DIODE_SCHTKY: DIODE SCH 1A 30V MICROSMP SMT; CLASS: IC; MFG_PN01: MSS1P3L-M3/89A; MFG_NAME01: VISHAY INTERTECHNOLOGY; CAD_APPROVED: Yes; AGILE_PN: 480-76978; PCB Footprint: smb_2p7x1p4; 3D_Mechanical_Footprint_File: http://fcl.am.freescale.net/ALLEGRO/step/smb_2p7x1p4.step; Rated Voltage: 30V; HEIGHT: 0.73MM
D7 D8 = DIODE_BIDIR: DIODE BIDIR 1-LINE ESD PROT 0.4pF 6V 2.5A AEC-Q101 SOD882; CLASS: IC; MFG_PN01: PESD5V0F1BL,315; MFG_NAME01: NEXPERIA; CAD_APPROVED: Yes; AGILE_PN: 480-78454; 3D_Mechanical_Footprint_File: http://fcl.am.freescale.net/ALLEGRO/step/sod882.STEP; Rated Voltage: 6V; HEIGHT: 0.5 MM; PCB Footprint: sod882
J6 = USB16_TYPEC_4SH: CON 2X8 USB2.0_TYPE_C RCPT 0.85MM 144H AU 63L; CLASS: IO; AGILE_PN: 210-82931; CAD_APPROVED: Yes; Temp Range: -40 ¡ãC to +85 ¡ãC; MFG_NAME01: GCT; MFG_PN01: USB4085-GF-A; HEIGHT: 3.66 MM; Package Type: Through Hole, Right Angle; ROHS: Yes; PCB Footprint: con16_usb_type-c_ra_th
J24 = CONN_HDR_2X1: HDR 1X2 TH 100MIL SP 342H AU 118L; CLASS: IO; JUMPER(DEFAULT): 1-2; AGILE_PN: 210-80468; CAD_APPROVED: Yes; Temp Range: -40¡ãC to 105¡ãC; MFG_NAME01: WURTH ELEKTRONIK EISOS GMBH & CO. KG (ELECTRONIC & ELECTROMEHANICAL COMP); MFG_PN01: 61300211121; HEIGHT: 8.69MM; Package Type: TH; ROHS: Yes; 3D_Mechanical_Footprint_File: http://fcl.am.freescale.net/ALLEGRO/step/hdr1x2_5p48x2p69.STEP; PCB Footprint: hdr1x2_5p48x2p69
JP1 JP2 = CONN_HDR_1X1: HDR 1X1 TH -- 330H AU 100L; CLASS: IO; MFG_PN01: HTSW-101-07-SM-S; MFG_NAME01: SAMTEC; CAD_APPROVED: Yes; AGILE_PN: 210-75767; 3D_Mechanical_Footprint_File: http://fcl.am.freescale.net/ALLEGRO/step/hdr101.STEP; ROHS: Yes; HEIGHT: 8.585 MM; Package Size: 2.54 x 2.54 mm; PCB Footprint: HDR101
L3 = BEAD: IND FER BEAD 330OHM@100MHZ 1.7A 0603; PART_TYPE: FERRITE\BEAD; CLASS: DISCRETE; AGILE_PN: 180-78156; Tolerance: 25%; MFG_NAME01: TDK; MFG_PN01: MPZ1608S331A; CAD_APPROVED: Yes; ROHS: Yes; HEIGHT: 0.95MM; TOL: 25%; PCB Footprint: ind_1608
L13 = DLW43: IND CHK 90 OHM@100MHZ 330MA 25% 0805; CLASS: DISCRETE; AGILE_PN: 180-76336; FPLIST: ind4_choke_0805_39h,ind4_choke_0805; CAD_APPROVED: Yes; Temp Range: -40¡ãC to +85¡ãC; MFG_NAME01: MURATA; MFG_PN01: DLW21HN900SQ2L; PCB Footprint: ind4_choke_0805_39h; HEIGHT: 1MM; ROHS: Yes; 3D_Mechanical_Footprint_File: http://fcl.am.freescale.net/ALLEGRO/step/ind4_choke_0805_39h.STEP
MH1-MH4 = MOUNT_HOLE: NON-PLATED MOUNTING HOLE 125 DRILL / 160 KEEPOUT NO PART TO ORDER; CLASS: IC; AGILE_PN: 510-75297; CAD_APPROVED: Yes; PCB Footprint: MH125-160; HEIGHT: 0.1 MM; ROHS: Yes
Q1 = 2SK3018: TRANS MOSFET N-CH 30V .1A SOT-323; CLASS: IC; MFG_PN01: 2SK3018T106; MFG_NAME01: ROHM; CAD_APPROVED: Yes; AGILE_PN: 480-75317; PCB Footprint: SOT323_3; ROHS: Yes; HEIGHT: 0.9MM
R24 = RES: RES MF 470 OHM 1/16W 5% 0402; CLASS: DISCRETE; Temp_Range: -55&#8451; to 155&#8451;; SIGNAL_MODEL: DEFAULT_RESISTOR_430.000000OHM_2_1; FPLIST: RC0402_25,RC0402_HD,0402_CC; CAD_APPROVED: Yes; MFG_PN01: ERJ2GEJ471X; MFG_NAME01: PANASONIC; AGILE_PN: 470-30315; TOL: 1%; PCB Footprint: RC0402_25; ROHS: Yes; Tolerance: 5%; HEIGHT: 0.45mm
R25 R28 = RES: as R156 on sheet 03 SOC_PORT0~2; PCB Footprint: RC0603_OV; HEIGHT: 0.6MM; ROHS: Yes
R26 R39 R41 = RES: RES MF 10K 1/16W 1% 0402; CLASS: DISCRETE; MFG_PN01: NRCL04F1002TRF; MFG_NAME01: NIC COMPONENTS CORP; CAD_APPROVED: Yes; FPLIST: RC0402_25,RC0402_HD,0402_CC,RC0402_X2; AGILE_PN: 470-80452; ROHS: Yes; Tolerance: 1%; HEIGHT: 0.40 MM; PCB Footprint: RC0402_25
R27 = RES: RES MF 10K 1/16W 1% 0402; CLASS: DISCRETE; Temp_Range: –55 °C to +155 °C; TOL: 5%; FPLIST: RC0402_25,RC0402_HD,0402_CC,RC0402_X2; CAD_APPROVED: Yes; MFG_PN01: NRCL04F1002TRF; MFG_NAME01: NIC COMPONENTS CORP; AGILE_PN: 470-80452; SIGNAL_MODEL: DEFAULT_RESISTOR_10000OHM_2_1; PCB Footprint: RC0402_25; HEIGHT: 0.40 MM; ROHS: Yes
R29 = RES: RES MF 20K 1/16W 1% 0402; CLASS: DISCRETE; AGILE_PN: 470-76103; FPLIST: RC0402_25,RC0402_HD,0402_CC; CAD_APPROVED: Yes; MFG_NAME01: WALSIN TECHNOLOGY CORP.; MFG_PN01: WR04X2002FTL; PCB Footprint: RC0402_25; HEIGHT: 0.4MM; ROHS: Yes
R32 = RES: as R149 on sheet 04 SOC_PORT3~5; ROHS: Yes; Tolerance: 5%; HEIGHT: 0.41mm; PCB Footprint: RC0402_25
R33 = RES: RES MF 100K 1/16W 1% 0402; CLASS: DISCRETE; AGILE_PN: 470-76240; FPLIST: RC0402_25,RC0402_HD,0402_CC; CAD_APPROVED: Yes; MFG_NAME01: BOURNS; MFG_PN01: CR0402-FX-1003GLF; HEIGHT: 0.4MM; Tolerance: 1%; ROHS: Yes; PCB Footprint: RC0402_25
R34 R44 = RES: as R159 on sheet 03 SOC_PORT0~2; PCB Footprint: RC0603_OV; ROHS: Yes; HEIGHT: 0.6MM
R35 R192 = RES: RES MF 1M 1/10W 5%  0805; CLASS: DISCRETE; AGILE_PN: 470-76691; FPLIST: RC0805_OV,RC0805,0805_CC; CAD_APPROVED: Yes; Temp Range: -55¡ãC to +175¡ãC; MFG_NAME01: SMEC; MFG_PN01: RC73L2A105JTF; HEIGHT: 0.55MM; Tolerance: 5%; ROHS: Yes; PCB Footprint: RC0805_OV
R36 = RES: RES MF 10K 1/16W 1% 0402; CLASS: DISCRETE; AGILE_PN: 470-80452; FPLIST: RC0402_25,RC0402_HD,0402_CC,RC0402_X2; CAD_APPROVED: Yes; MFG_NAME01: NIC COMPONENTS CORP; MFG_PN01: NRCL04F1002TRF; HEIGHT: 0.40 MM; Tolerance: 1%; ROHS: Yes; PCB Footprint: RC0402_25
R37 R38 R49 = RES: RES MF 10K 1/16W 1% 0402; CLASS: DISCRETE; TOL: 5%; FPLIST: RC0402_25,RC0402_HD,0402_CC,RC0402_X2; CAD_APPROVED: Yes; MFG_PN01: NRCL04F1002TRF; MFG_NAME01: NIC COMPONENTS CORP; AGILE_PN: 470-80452; SIGNAL_MODEL: DEFAULT_RESISTOR_10000OHM_2_1; Temp_Range: –55 °C to +155 °C; PCB Footprint: RC0402_25; HEIGHT: 0.40 MM; ROHS: Yes; Tolerance: 1%
R40 R42 R50 = RES: RES MF 10K 1/16W 1% 0402; CLASS: DISCRETE; Temp_Range: –55 °C to +155 °C; SIGNAL_MODEL: DEFAULT_RESISTOR_10000OHM_2_1; AGILE_PN: 470-80452; MFG_NAME01: NIC COMPONENTS CORP; MFG_PN01: NRCL04F1002TRF; CAD_APPROVED: Yes; FPLIST: RC0402_25,RC0402_HD,0402_CC,RC0402_X2; TOL: 5%; PCB Footprint: RC0402_25; Tolerance: 1%; ROHS: Yes; HEIGHT: 0.40 MM
R43 R45-R48 R203 = RES: RES MF ZERO OHM 1/16W 5% 0402; CLASS: DISCRETE; MFG_PN01: CR0402-J/-000GLF; MFG_NAME01: BOURNS; CAD_APPROVED: Yes; FPLIST: RC0402_25,RC0402_HD,RC0402_X2,0402_CC,rc0402_lamp3; AGILE_PN: 470-75394; PCB Footprint: RC0402_25; ROHS: Yes; Tolerance: 5%; HEIGHT: 0.45 MM
U2 = XC6227C_5P: IC VREG LDO  3.3V 0.7A 1.7-6.0V SOT-89-5; AGILE_PN: 315-80827; CAD_APPROVED: Yes; VOLTAGE: 1.7V ~ 6.0V; MFG_NAME01: TOREX; CLASS: IC; HEIGHT: 1.6MM; ROHS: Yes; MFG_PN01: XC6227C331PR-G; PCB Footprint: SOT89-5
U3 = NX5P3090UK_WLCSP12: IC USB PD TYPE C CURRENT LIMITED PWR SW 2.5-5.5V WLCSP12; MFG_PN01: NX5P3090UK,012; MFG_NAME01: NXP SEMICONDUCTORS; CAD_APPROVED: Yes; AGILE_PN: 312-81574; CLASS: IC; PCB Footprint: wlcsp12_0p4_1p38x1p68mm_smdp; 3D_Mechanical_Footprint_File: http://fcl.am.freescale.net/ALLEGRO/step/wlcsp12_0p4_1p38x1p68mm_smdp.STEP; ROHS: Yes; HEIGHT: 0.565 MM
U4 = RCLAMP1654P_NEW: DIODE TVS ARRAY 3 5.5V SLP1616P6; CLASS: IC; AGILE_PN: 480-78843; MFG_NAME01: SEMTECH CORP; CAD_APPROVED: Yes; 3D_Mechanical_Footprint_File: http://fcl.am.freescale.net/ALLEGRO/step/slp1616p6.step; VOLTAGE: 5.5V; Rated Voltage: 5.5V; MFG_PN01: RClamp0854P.TCT; ROHS: Yes; HEIGHT: 0.65MM; PCB Footprint: slp1616p6
U5 = PTN5150A_X2QFN12: IC CC LOGIC USB TYPE-C 2.7-5.5V X2QFN12; AGILE_PN: 312-81473; CAD_APPROVED: Yes; MFG_NAME01: NXP SEMICONDUCTORS; MFG_PN01: PTN5150AHXMP; CLASS: IC; HEIGHT: 0.4MM; ROHS: Yes; VOLTAGE: 2.7-5.5V; 3D_Mechanical_Footprint_File: http://fcl.am.freescale.net/ALLEGRO/step/x2qfn12_0p4_1p6x1p6.STEP; PCB Footprint: x2qfn12_0p4_1p6x1p6